# EAGLE schematic perspection-v1 (EAGLE 6.6.0)

## Sheet 1 of 8
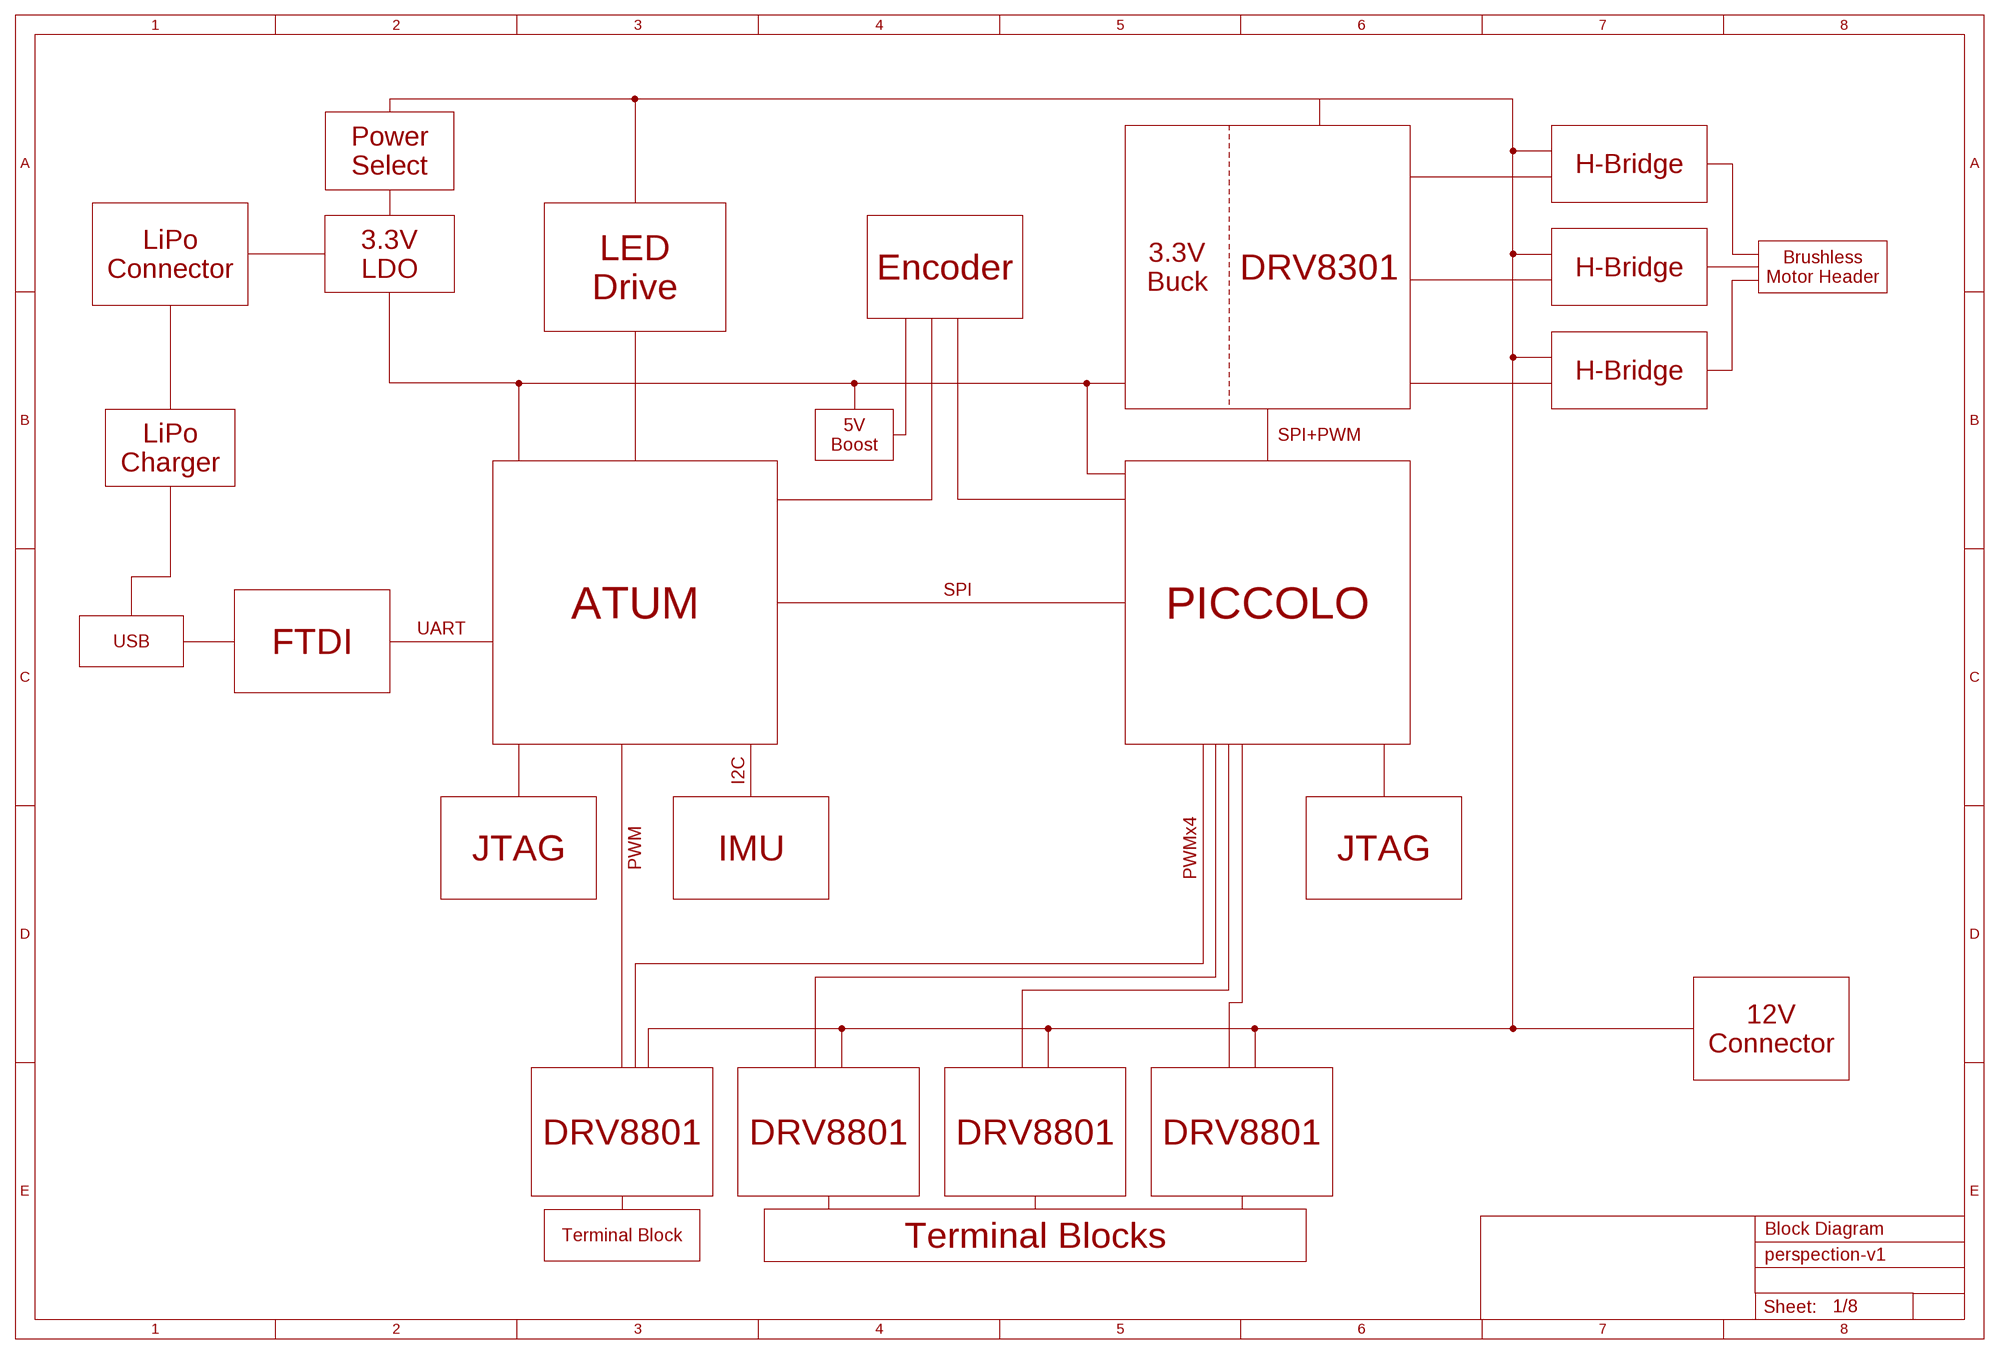
[diagram p0: schematic, sheet 1]

### Notes on the sheet
- Power
  Select
- H-Bridge
- LiPo
  Connector
- 3.3V
  LDO
- LED
  Drive
- Encoder
- 3.3V
  Buck
- DRV8301 | H-Bridge
- Brushless
  Motor Header
- H-Bridge
- 5V
  Boost
- SPI+PWM
- LiPo
  Charger
- SPI
- ATUM | PICCOLO
- UART
- USB | FTDI
- I2C
- JTAG | PWM | IMU | PWMx4 | JTAG
- 12V
  Connector
- DRV8801 | DRV8801 | DRV8801 | DRV8801
- Terminal Block | Terminal Blocks

## Sheet 2 of 8
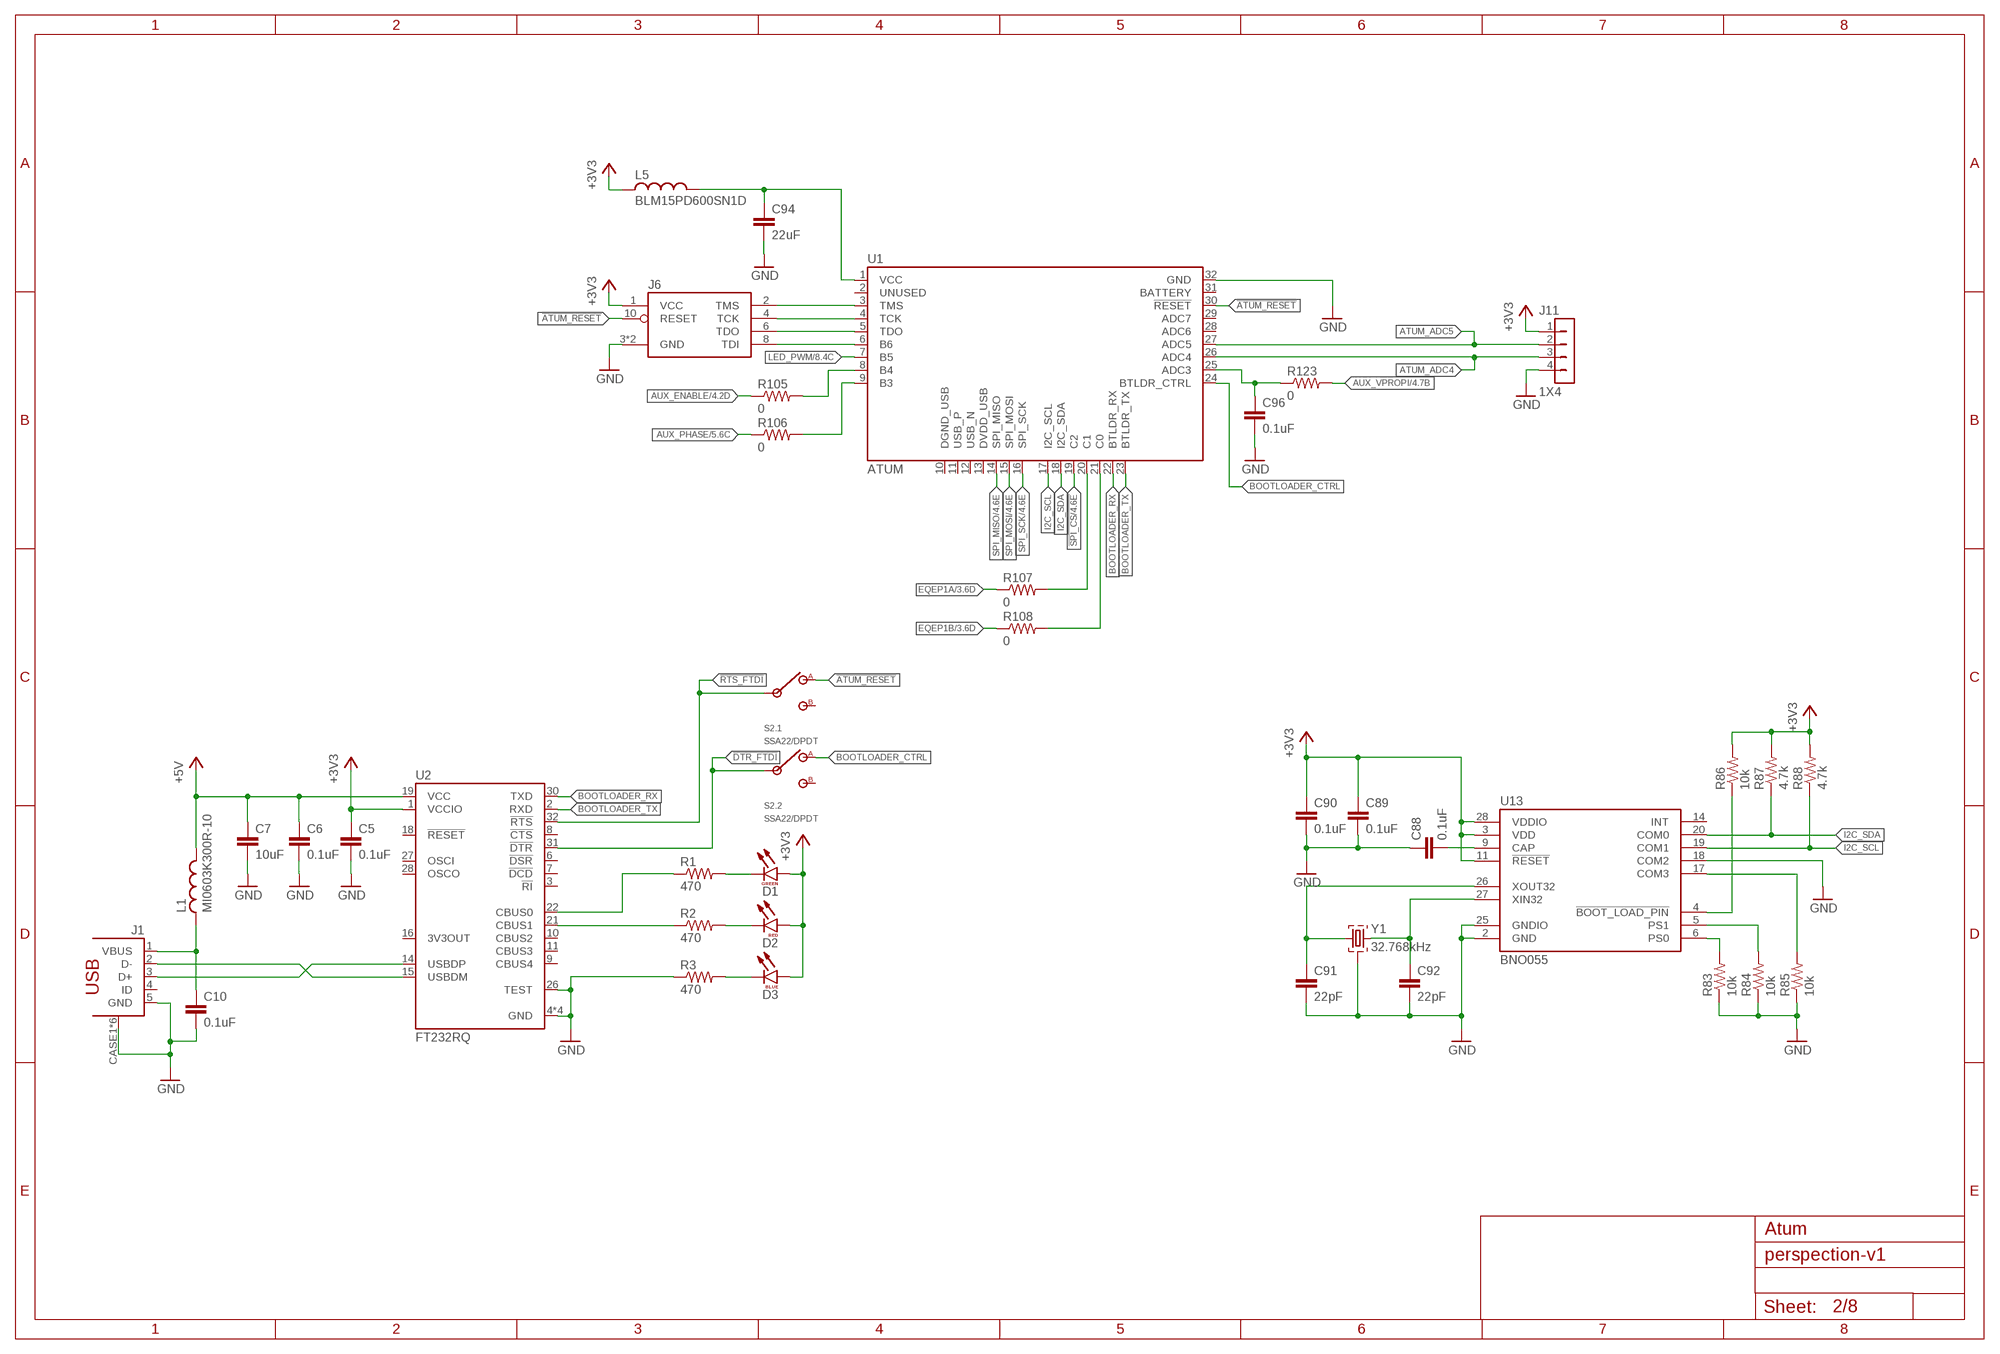
[diagram p1: schematic, sheet 2]

### Parts
C5  0.1uF  C0402  [C0402]
C6  0.1uF  C0402  [C0402]
C7  10uF  C1206  [C1206]
C10  0.1uF  C0402  [C0402]
C88  0.1uF  C0402  [C0402]
C89  0.1uF  C0402  [C0402]
C90  0.1uF  C0402  [C0402]
C91  22pF  C0402  [C0402]
C92  22pF  C0402  [C0402]
C94  22uF  C1206  [C1206]
C96  0.1uF  C0402  [C0402]
D1  LED0603  [LED0603]
D2  LED0603  [LED0603]
D3  LED0603  [LED0603]
J1  MICRO-USB-10118192-0001LF  [MICRO-USB]
J6  JTAG-ARM_TC-10  [TC2050-IDC]
J11  1X4  [1X4_0.1IN_THRUHOLE]
L1  MI0603K300R-10  L0603  [L0603]
L5  BLM15PD600SN1D  L0402  [L0402]
R1  470  R0402  [R0402]
R2  470  R0402  [R0402]
R3  470  R0402  [R0402]
R83  10k  R0402  [R0402]
R84  10k  R0402  [R0402]
R85  10k  R0402  [R0402]
R86  10k  R0402  [R0402]
R87  4.7k  R0402  [R0402]
R88  4.7k  R0402  [R0402]
R105  0  R0402  [R0402]
R106  0  R0402  [R0402]
R107  0  R0402  [R0402]
R108  0  R0402  [R0402]
R123  0  R0402  [R0402]
S2  SSA22/DPDT  [SSA22/DPDT]
U1  ATUM  [ATUM]
U2  FT232RQ  [QFN32]
U13  BNO055  [LGA-28]
Y1  32.768kHz  CM200C32768HZFT  [SOJ-4]

### Nets
!ATUM_RESET: J6.10(RESET) S2.A1 U1.30(!RESET)
!DTR_FTDI: S2.COM2 U2.31(!DTR)
!RTS_FTDI: S2.COM1 U2.32(!RTS)
!SPI_CS: U1.19(C2) ; also sheet 4
+3V3: C5.1 C89.1 C90.1 D1.ANODE D2.ANODE D3.ANODE J6.1(VCC) J11.1 L5.1 R86.2 R87.2 R88.2 U2.1(VCCIO) U13.3(VDD) U13.11(!RESET) U13.28(VDDIO) ; also sheet 3,4,5,6,8
+5V: C6.1 C7.1 L1.2 U2.19(VCC) ; also sheet 3
ATUM_ADC4: J11.3 U1.26(ADC4)
ATUM_ADC5: J11.2 U1.27(ADC5)
ATUM_C0: R108.2 U1.21(C0)
ATUM_C1: R107.2 U1.20(C1)
ATUM_TCK: J6.4(TCK) U1.4(TCK)
ATUM_TDO: J6.6(TDO) U1.5(TDO)
ATUM_TMS: J6.2(TMS) U1.3(TMS)
AUX_ENABLE: R105.1 ; also sheet 4,5
AUX_PHASE: R106.1 ; also sheet 5
AUX_VPROPI: R123.2 ; also sheet 4,5
BOOTLOADER_CTRL: S2.A2 U1.24(BTLDR_CTRL)
BOOTLOADER_RX: U1.22(BTLDR_RX) U2.30(TXD)
BOOTLOADER_TX: U1.23(BTLDR_TX) U2.2(RXD)
D_N: J1.2(D-) U2.15(USBDM)
D_P: J1.3(D+) U2.14(USBDP)
EQEP1A: R107.1 ; also sheet 3,4
EQEP1B: R108.1 ; also sheet 3,4
GND: C5.2 C6.2 C7.2 C10.2 C88.1 C89.2 C90.2 C91.2 C92.2 C94.2 C96.2 J1.5(GND) J1.CASE1(MTN4) J1.CASE2(MTN4) J1.CASE3(MTN4) J1.CASE4(MTN4) J1.CASE5(MTN4) J1.CASE6(MTN4) J6.3(GND) J6.9(GND) J11.4 R3.1 R83.1 R84.1 R85.1 U1.32(GND) U2.4(GND) U2.17(GND) U2.20(GND) U2.24(GND) U2.26(TEST) U13.2(GND) U13.18(COM2) U13.25(GNDIO) Y1.2 Y1.3 ; also sheet 3,4,5,6,7,8
I2C_SCL: R88.1 U1.17(I2C_SCL) U13.19(COM1)
I2C_SDA: R87.1 U1.18(I2C_SDA) U13.20(COM0)
LED_PWM: U1.7(B5) ; also sheet 8
N$1: D2.CATHODE R2.2
N$2: D1.CATHODE R1.2
N$3: R2.1 U2.21(CBUS1)
N$4: R1.1 U2.22(CBUS0)
N$5: D3.CATHODE R3.2
N$7: C96.1 R123.1 U1.25(ADC3)
N$8: C10.1 J1.1(VBUS) L1.1
N$47: R105.2 U1.8(B4)
N$48: R106.2 U1.9(B3)
N$72: R84.2 U13.5(PS1)
N$73: R83.2 U13.6(PS0)
N$74: C92.1 U13.27(XIN32) Y1.4
N$75: C88.2 U13.9(CAP)
N$76: C91.1 U13.26(XOUT32) Y1.1
N$80: R85.2 U13.17(COM3)
N$85: R86.1 U13.4(!BOOT_LOAD_PIN)
N$89: C94.1 L5.2 U1.1(VCC)
N$90: J6.8(TDI) U1.6(B6)
SPI_MISO: U1.14(SPI_MISO) ; also sheet 4
SPI_MOSI: U1.15(SPI_MOSI) ; also sheet 4
SPI_SCK: U1.16(SPI_SCK) ; also sheet 4
Unconnected: J1.4(ID) S2.B1 S2.B2 U1.2(UNUSED) U1.10(DGND_USB) U1.11(USB_P) U1.12(USB_N) U1.13(DVDD_USB) U1.28(ADC6) U1.29(ADC7) U1.31(BATTERY) U2.3(!RI) U2.6(!DSR) U2.7(!DCD) U2.8(!CTS) U2.9(CBUS4) U2.10(CBUS2) U2.11(CBUS3) U2.16(3V3OUT) U2.18(!RESET) U2.27(OSCI) U2.28(OSCO) U13.14(INT)

## Sheet 3 of 8
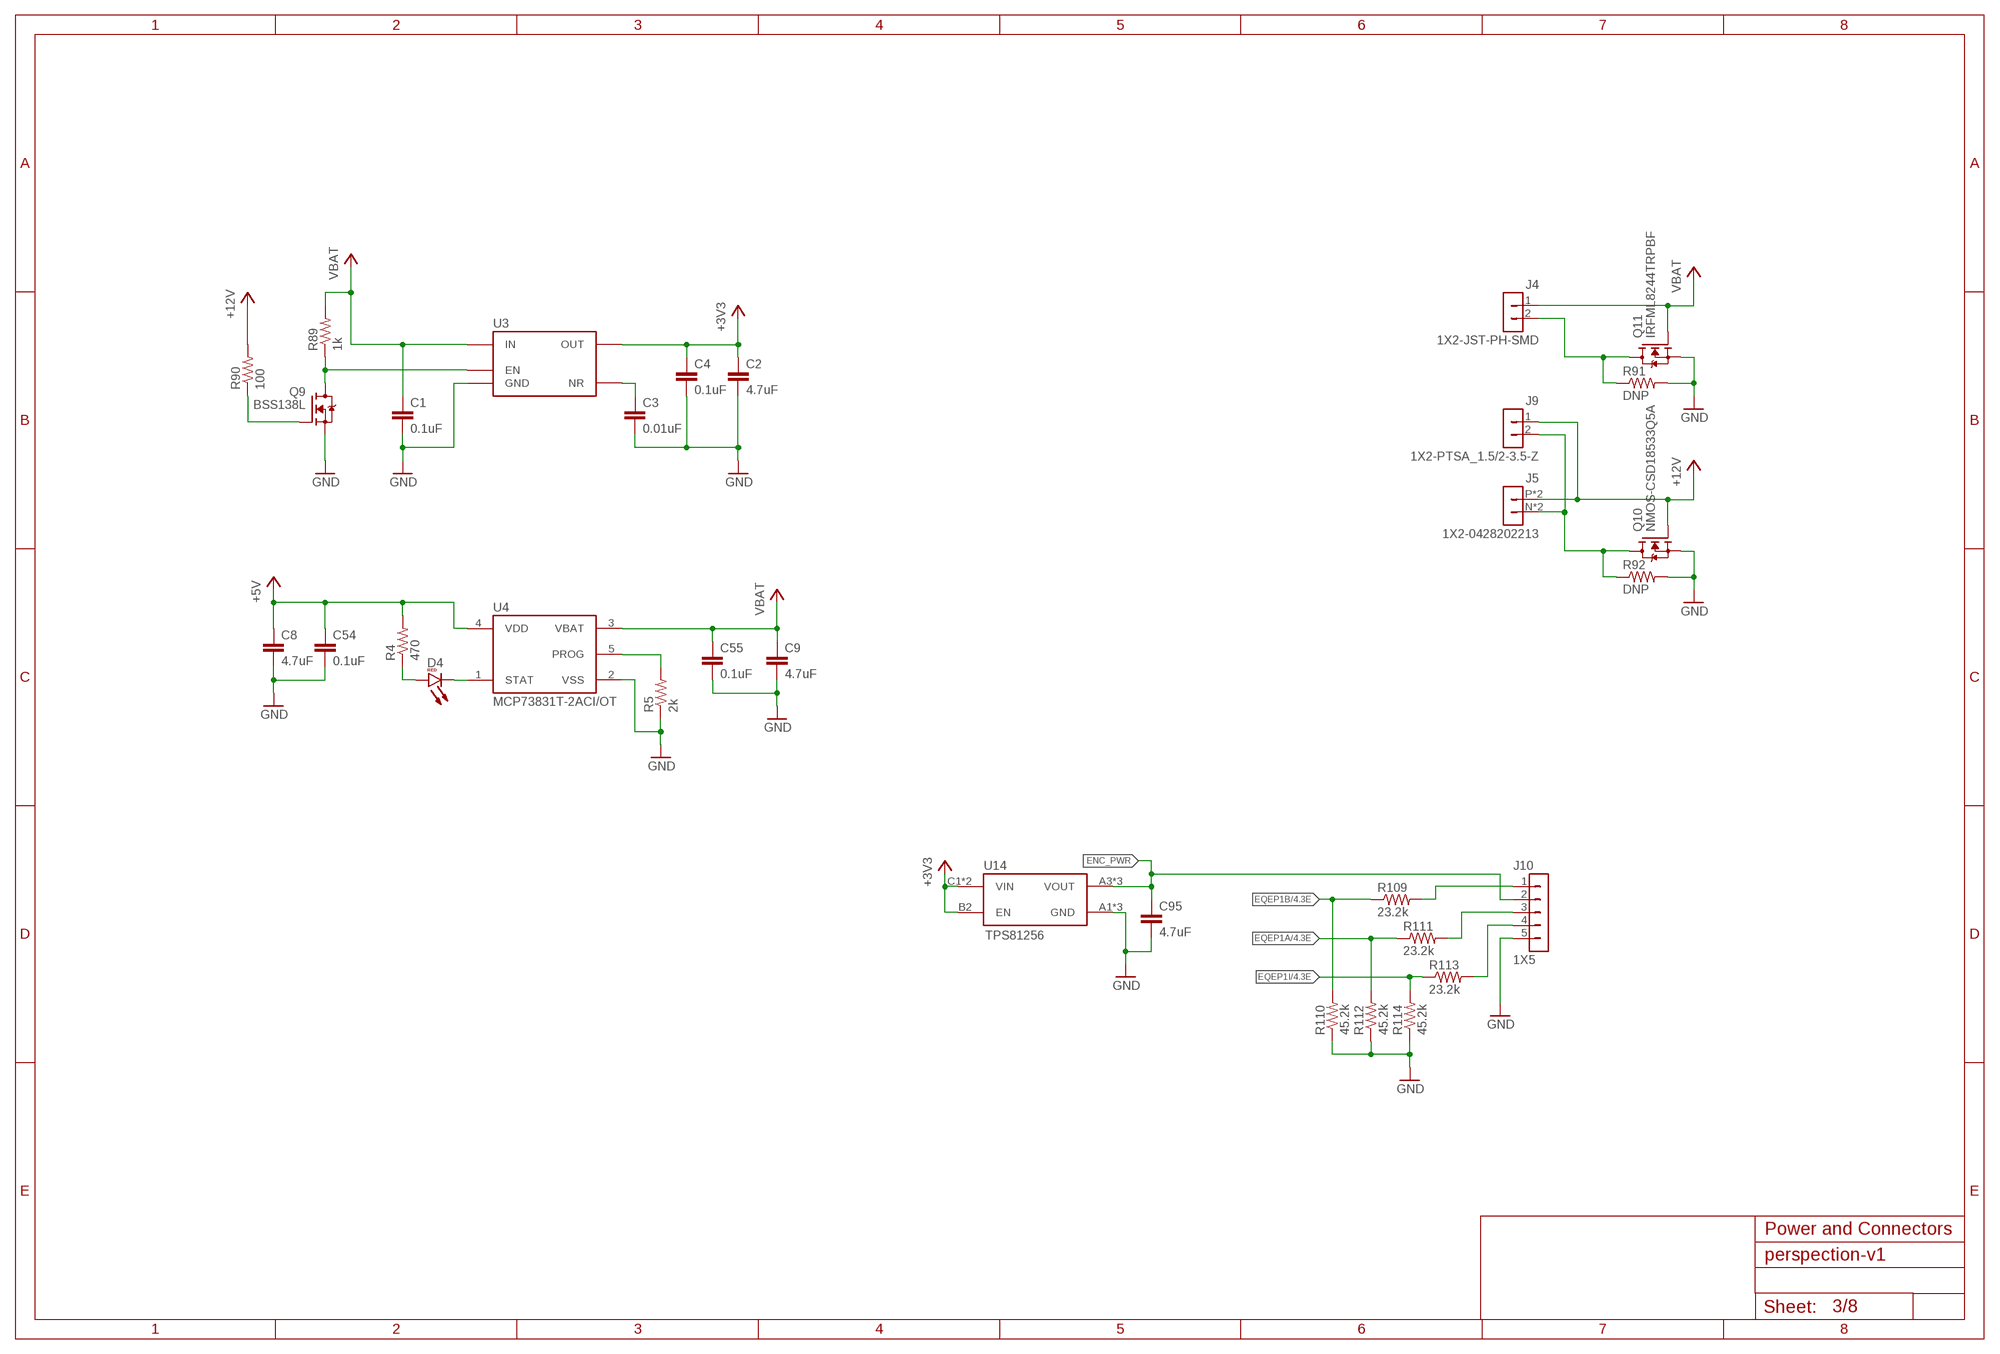
[diagram p2: schematic, sheet 3]

### Parts
C1  0.1uF  C0402  [C0402]
C2  4.7uF  C0805  [C0805]
C3  0.01uF  C0402  [C0402]
C4  0.1uF  C0402  [C0402]
C8  4.7uF  C0805  [C0805]
C9  4.7uF  C0805  [C0805]
C54  0.1uF  C0402  [C0402]
C55  0.1uF  C0402  [C0402]
C95  4.7uF  C0603  [C0603]
D4  LED0603  [LED0603]
J4  1X2-JST-PH-SMD  [JST-PH-2-SMD]
J5  1X2-0428202213  [MOLEX_SABRE_2POS]
J9  1X2-PTSA_1.5/2-3.5-Z  [3.5MM_PTSA_1.5/2-3.5-Z]
J10  1X5  [1X5_0.1IN_THRUHOLE]
Q9  BSS138L  [SOT23]
Q10  NMOS-CSD18533Q5A  [SON-5X6]
Q11  IRFML8244TRPBF  [SOT23]
R4  470  R0402  [R0402]
R5  2k  R0402  [R0402]
R89  1k  R0402  [R0402]
R90  100  R0402  [R0402]
R91  DNP  R0402  [R0402]
R92  DNP  R0805  [R0805]
R109  23.2k  R0402  [R0402]
R110  45.2k  R0402  [R0402]
R111  23.2k  R0402  [R0402]
R112  45.2k  R0402  [R0402]
R113  23.2k  R0402  [R0402]
R114  45.2k  R0402  [R0402]
U3  TPS79933DDCR  [SOT23-5]
U4  MCP73831T-2ACI/OT  [SOT23-5]
U14  TPS81256  [TI-SIP-9]

### Nets
+3V3: C2.1 C4.1 U3.5(OUT) U14.B2(EN) U14.C1(VIN) U14.C2(VIN) ; also sheet 2,4,5,6,8
+5V: C8.1 C54.1 R4.2 U4.4(VDD) ; also sheet 2
+12V: J5.P J5.P2 J9.1 Q10.G R90.2 ; also sheet 5,6,7,8
+12V_GND: J5.N J5.N2 J9.2 Q10.D R92.1
ENC_PWR: C95.1 J10.2 U14.A3(VOUT) U14.B3(VOUT) U14.C3(VOUT)
EQEP1A: R111.1 R112.2 ; also sheet 2,4
EQEP1B: R109.1 R110.2 ; also sheet 2,4
EQEP1I: R113.1 R114.2 ; also sheet 4
GND: C1.2 C2.2 C3.2 C4.2 C8.2 C9.2 C54.2 C55.2 C95.2 J10.5 Q9.2(S) Q10.S1(S) Q10.S2(S) Q10.S3(S) Q11.2(S) R5.1 R91.2 R92.2 R110.1 R112.1 R114.1 U3.2(GND) U4.2(VSS) U14.A1(GND) U14.A2(GND) U14.B1(GND) ; also sheet 2,4,5,6,7,8
N$6: J10.1 R109.2
N$9: D4.CATHODE U4.1(STAT)
N$10: C3.1 U3.4(NR)
N$11: D4.ANODE R4.1
N$12: R5.2 U4.5(PROG)
N$16: J10.3 R111.2
N$17: J10.4 R113.2
N$81: Q9.3(D) R89.1 U3.3(EN)
N$87: Q9.1(G) R90.1
VBAT: C1.1 C9.1 C55.1 J4.1 Q11.1(G) R89.2 U3.1(IN) U4.3(VBAT)
VBAT_GND: J4.2 Q11.3(D) R91.1

## Sheet 4 of 8
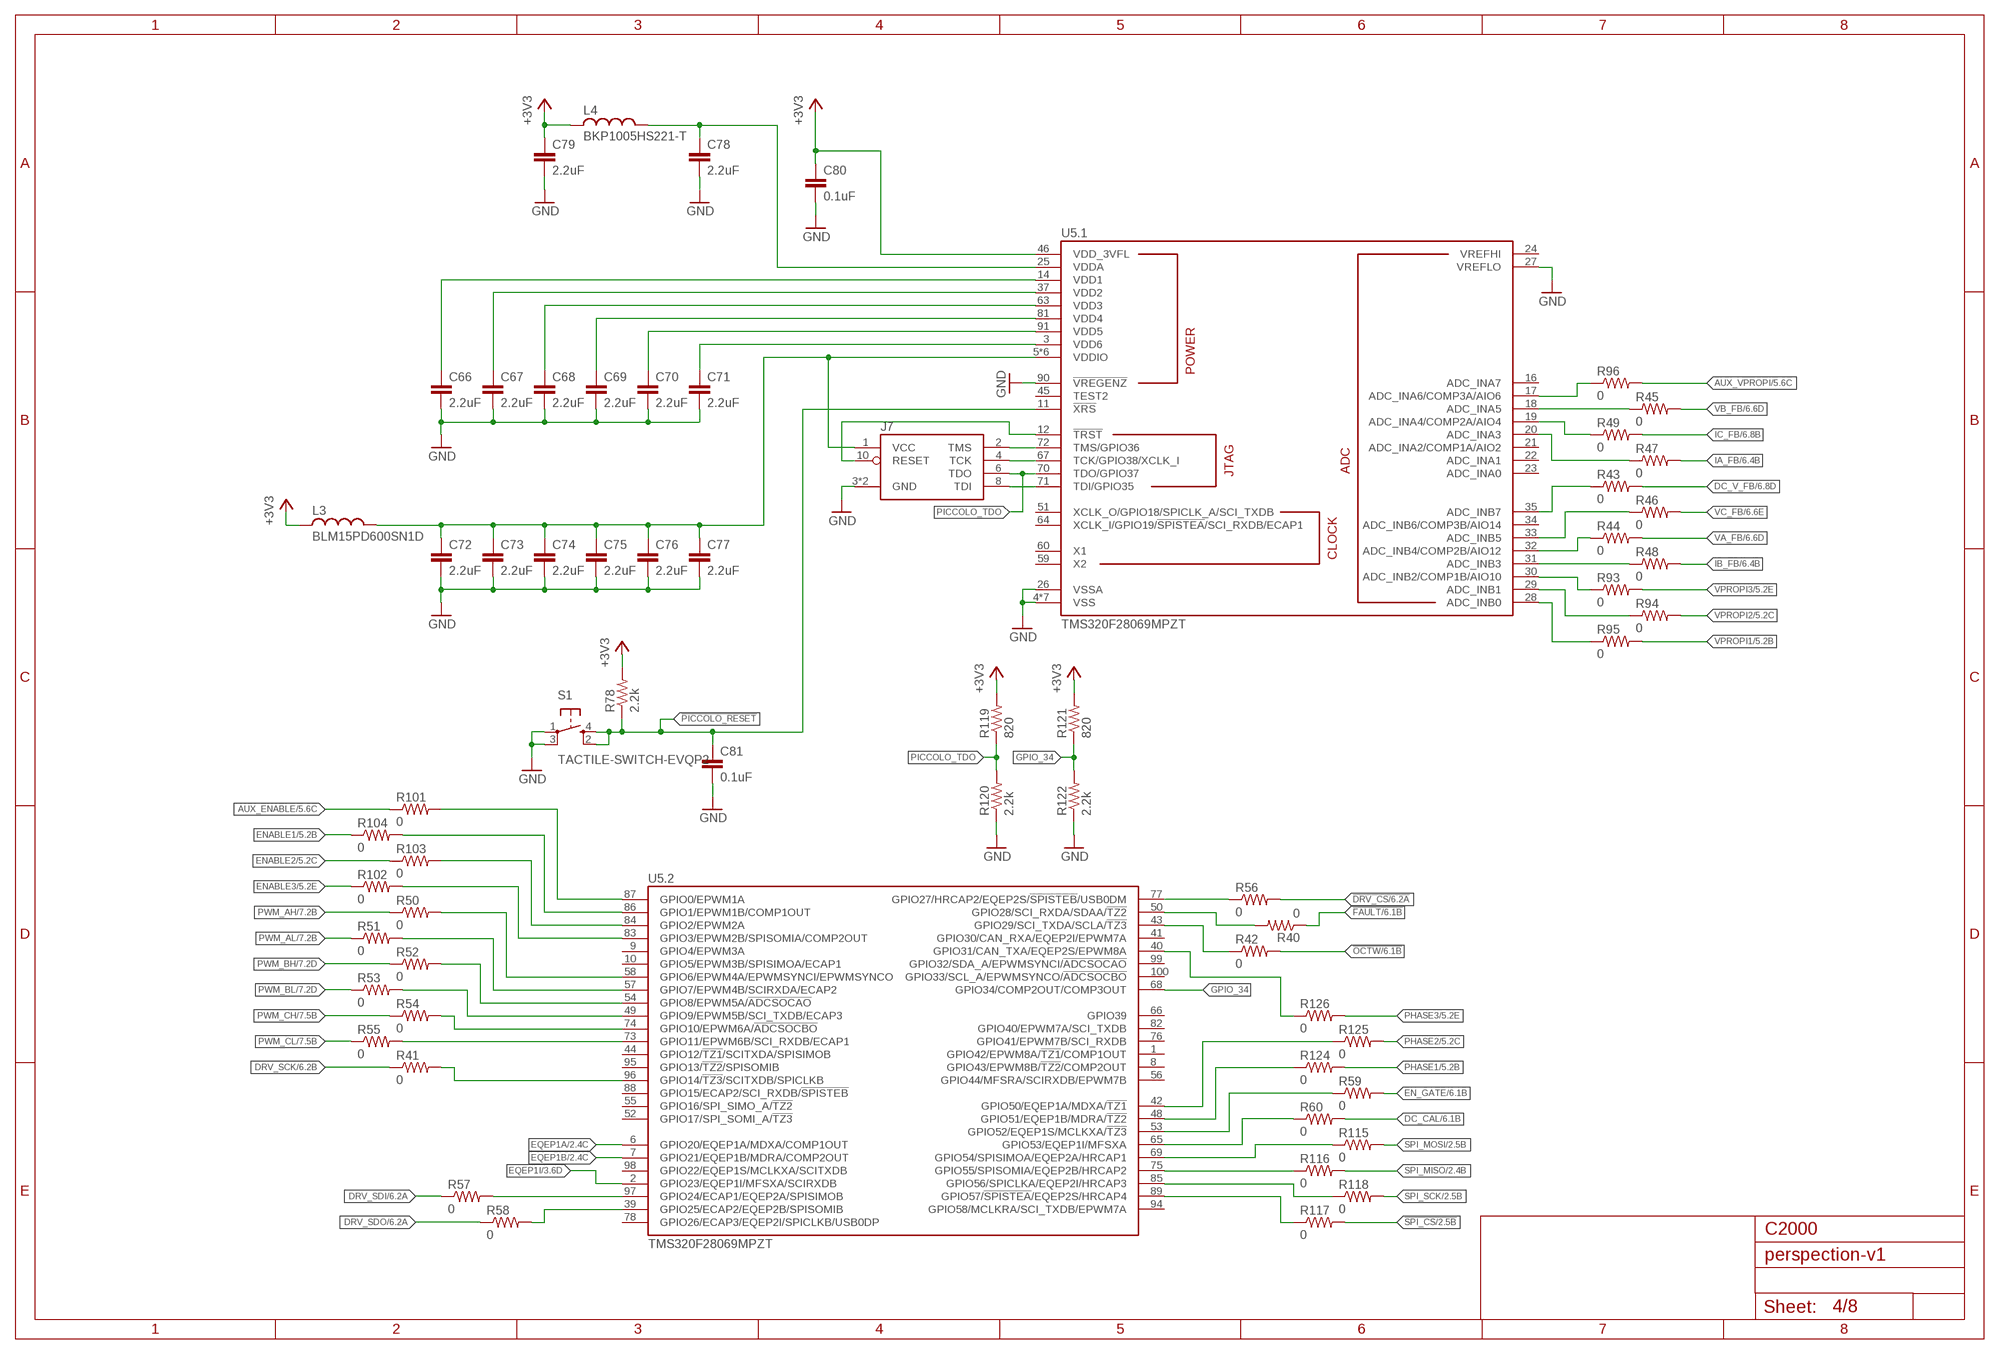
[diagram p3: schematic, sheet 4]

### Parts
C66  2.2uF  C0402  [C0402]
C67  2.2uF  C0402  [C0402]
C68  2.2uF  C0402  [C0402]
C69  2.2uF  C0402  [C0402]
C70  2.2uF  C0402  [C0402]
C71  2.2uF  C0402  [C0402]
C72  2.2uF  C0402  [C0402]
C73  2.2uF  C0402  [C0402]
C74  2.2uF  C0402  [C0402]
C75  2.2uF  C0402  [C0402]
C76  2.2uF  C0402  [C0402]
C77  2.2uF  C0402  [C0402]
C78  2.2uF  C0402  [C0402]
C79  2.2uF  C0402  [C0402]
C80  0.1uF  C0402  [C0402]
C81  0.1uF  C0402  [C0402]
J7  JTAG-ARM_TC-10  [TC2050-IDC]
L3  BLM15PD600SN1D  L0402  [L0402]
L4  BKP1005HS221-T  L0402  [L0402]
R40  0  R0402  [R0402]
R41  0  R0402  [R0402]
R42  0  R0402  [R0402]
R43  0  R0402  [R0402]
R44  0  R0402  [R0402]
R45  0  R0402  [R0402]
R46  0  R0402  [R0402]
R47  0  R0402  [R0402]
R48  0  R0402  [R0402]
R49  0  R0402  [R0402]
R50  0  R0402  [R0402]
R51  0  R0402  [R0402]
R52  0  R0402  [R0402]
R53  0  R0402  [R0402]
R54  0  R0402  [R0402]
R55  0  R0402  [R0402]
R56  0  R0402  [R0402]
R57  0  R0402  [R0402]
R58  0  R0402  [R0402]
R59  0  R0402  [R0402]
R60  0  R0402  [R0402]
R78  2.2k  R0402  [R0402]
R93  0  R0402  [R0402]
R94  0  R0402  [R0402]
R95  0  R0402  [R0402]
R96  0  R0402  [R0402]
R101  0  R0402  [R0402]
R102  0  R0402  [R0402]
R103  0  R0402  [R0402]
R104  0  R0402  [R0402]
R115  0  R0402  [R0402]
R116  0  R0402  [R0402]
R117  0  R0402  [R0402]
R118  0  R0402  [R0402]
R119  820  R0402  [R0402]
R120  2.2k  R0402  [R0402]
R121  820  R0402  [R0402]
R122  2.2k  R0402  [R0402]
R124  0  R0402  [R0402]
R125  0  R0402  [R0402]
R126  0  R0402  [R0402]
S1  TACTILE-SWITCH-EVQP2  [EVQP2]
U5  TMS320F28069MPZT  [TI-LQFP-100]

### Nets
!DRV_CS: R56.2 ; also sheet 6
!FAULT: R40.1 ; also sheet 6
!OCTW: R42.2 ; also sheet 6
!PICCOLO_RESET: C81.1 R78.1 S1.2 S1.4 U5.11(.1:!XRS)
!PICCOLO_TRST: J7.10(RESET) U5.12(.1:!TRST)
!SPI_CS: R117.2 ; also sheet 2
+3V3: C79.1 C80.1 L3.1 L4.1 R78.2 R119.2 R121.2 U5.46(.1:VDD_3VFL) ; also sheet 2,3,5,6,8
_!DRV_CS: R56.1 U5.77(.2:GPIO27/HRCAP2/EQEP2S/!SPISTEB!/USB0DM)
_!SPI_CS: R117.1 U5.89(.2:GPIO57/!SPISTEA!/EQEP2S/HRCAP4)
__IA_FB: R47.1 U5.20(.1:ADC_INA3)
__IB_FB: R48.1 U5.31(.1:ADC_INB3)
__IC_FB: R49.1 U5.19(.1:ADC_INA4/COMP2A/AIO4)
_DC_CAL: R60.1 U5.65(.2:GPIO53/EQEP1I/MFSXA)
_DC_V_FB: R43.1 U5.35(.1:ADC_INB7)
_DRV_SCK: R41.2 U5.96(.2:GPIO14/!TZ3!/SCITXDB/SPICLKB)
_DRV_SDO: R58.2 U5.39(.2:GPIO25/ECAP2/EQEP2B/SPISOMIB)
_EN_GATE: R59.1 U5.53(.2:GPIO52/EQEP1S/MCLKXA/!TZ3)
_PHASE1: R124.1 U5.48(.2:GPIO51/EQEP1B/MDRA/!TZ2)
_PHASE2: R125.1 U5.42(.2:GPIO50/EQEP1A/MDXA/!TZ1)
_PWM_AH: R50.2 U5.58(.2:GPIO6/EPWM4A/EPWMSYNCI/EPWMSYNCO)
_PWM_AL: R51.2 U5.57(.2:GPIO7/EPWM4B/SCIRXDA/ECAP2)
_PWM_BH: R52.2 U5.54(.2:GPIO8/EPWM5A/!ADCSOCAO)
_PWM_BL: R53.2 U5.49(.2:GPIO9/EPWM5B/SCI_TXDB/ECAP3)
_PWM_CH: R54.2 U5.74(.2:GPIO10/EPWM6A/!ADCSOCBO)
_PWM_CL: R55.2 U5.73(.2:GPIO11/EPWM6B/SCI_RXDB/ECAP1)
_SPI_MISO: R116.1 U5.75(.2:GPIO55/SPISOMIA/EQEP2B/HRCAP2)
_SPI_MOSI: R115.1 U5.69(.2:GPIO54/SPISIMOA/EQEP2A/HRCAP1)
_SPI_SCK: R118.1 U5.85(.2:GPIO56/SPICLKA/EQEP2I/HRCAP3)
_VA_FB: R44.1 U5.32(.1:ADC_INB4/COMP2B/AIO12)
_VB_FB: R45.1 U5.18(.1:ADC_INA5)
_VC_FB: R46.1 U5.33(.1:ADC_INB5)
AUX_ENABLE: R101.1 ; also sheet 2,5
AUX_VPROPI: R96.2 ; also sheet 2,5
DC_CAL: R60.2 ; also sheet 6
DC_V_FB: R43.2 ; also sheet 6
DRV_SCK: R41.1 ; also sheet 6
DRV_SDI: R57.1 ; also sheet 6
DRV_SDO: R58.1 ; also sheet 6
EN_GATE: R59.2 ; also sheet 6
ENABLE1: R104.1 ; also sheet 5
ENABLE2: R103.1 ; also sheet 5
ENABLE3: R102.1 ; also sheet 5
EQEP1A: U5.6(.2:GPIO20/EQEP1A/MDXA/COMP1OUT) ; also sheet 2,3
EQEP1B: U5.7(.2:GPIO21/EQEP1B/MDRA/COMP2OUT) ; also sheet 2,3
EQEP1I: U5.2(.2:GPIO23/EQEP1I/MFSXA/SCIRXDB) ; also sheet 3
GND: C66.2 C67.2 C68.2 C69.2 C70.2 C71.2 C72.2 C73.2 C74.2 C75.2 C76.2 C77.2 C78.2 C79.2 C80.2 C81.2 J7.3(GND) J7.9(GND) R120.1 R122.1 S1.1 S1.3 U5.4(.1:VSS) U5.15(.1:VSS) U5.26(.1:VSSA) U5.27(.1:VREFLO) U5.36(.1:VSS) U5.47(.1:VSS) U5.62(.1:VSS) U5.80(.1:VSS) U5.90(.1:!VREGENZ) U5.92(.1:VSS) ; also sheet 2,3,5,6,7,8
GPIO_34: R121.1 R122.2 U5.68(.2:GPIO34/COMP2OUT/COMP3OUT)
IA_FB: R47.2 ; also sheet 6
IB_FB: R48.2 ; also sheet 6
IC_FB: R49.2 ; also sheet 6
N$21: R57.2 U5.97(.2:GPIO24/ECAP1/EQEP2A/SPISIMOB)
N$25: R93.1 U5.30(.1:ADC_INB2/COMP1B/AIO10)
N$26: R94.1 U5.29(.1:ADC_INB1)
N$27: R95.1 U5.28(.1:ADC_INB0)
N$31: R96.1 U5.17(.1:ADC_INA6/COMP3A/AIO6)
N$32: R102.2 U5.83(.2:GPIO3/EPWM2B/SPISOMIA/COMP2OUT)
N$43: R103.2 U5.84(.2:GPIO2/EPWM2A)
N$44: R104.2 U5.86(.2:GPIO1/EPWM1B/COMP1OUT)
N$46: R101.2 U5.87(.2:GPIO0/EPWM1A)
N$49: R42.1 U5.43(.2:GPIO29/SCI_TXDA/SCLA/!TZ3)
N$50: R126.1 U5.40(.2:GPIO31/CAN_TXA/EQEP2S/EPWM8A)
N$51: C72.1 C73.1 C74.1 C75.1 C76.1 C77.1 J7.1(VCC) L3.2 U5.5(.1:VDDIO) U5.13(.1:VDDIO) U5.38(.1:VDDIO) U5.61(.1:VDDIO) U5.79(.1:VDDIO) U5.93(.1:VDDIO)
N$52: R40.2 U5.50(.2:GPIO28/SCI_RXDA/SDAA/!TZ2)
N$56: C78.1 L4.2 U5.25(.1:VDDA)
PHASE1: R124.2 ; also sheet 5
PHASE2: R125.2 ; also sheet 5
PHASE3: R126.2 ; also sheet 5
PICCOLO_TCK: J7.4(TCK) U5.67(.1:TCK/GPIO38/XCLK_I)
PICCOLO_TDI: J7.8(TDI) U5.71(.1:TDI/GPIO35)
PICCOLO_TDO: J7.6(TDO) R119.1 R120.2 U5.70(.1:TDO/GPIO37)
PICCOLO_TMS: J7.2(TMS) U5.72(.1:TMS/GPIO36)
PWM_AH: R50.1 ; also sheet 7
PWM_AL: R51.1 ; also sheet 7
PWM_BH: R52.1 ; also sheet 7
PWM_BL: R53.1 ; also sheet 7
PWM_CH: R54.1 ; also sheet 7
PWM_CL: R55.1 ; also sheet 7
SPI_MISO: R116.2 ; also sheet 2
SPI_MOSI: R115.2 ; also sheet 2
SPI_SCK: R118.2 ; also sheet 2
VA_FB: R44.2 ; also sheet 6
VB_FB: R45.2 ; also sheet 6
VC_FB: R46.2 ; also sheet 6
VDD1: C66.1 U5.14(.1:VDD1)
VDD2: C67.1 U5.37(.1:VDD2)
VDD3: C68.1 U5.63(.1:VDD3)
VDD4: C69.1 U5.81(.1:VDD4)
VDD5: C70.1 U5.91(.1:VDD5)
VDD6: C71.1 U5.3(.1:VDD6)
VPROPI1: R95.2 ; also sheet 5
VPROPI2: R94.2 ; also sheet 5
VPROPI3: R93.2 ; also sheet 5
Unconnected: U5.1(.2:GPIO42/EPWM8A/!TZ1!/COMP1OUT) U5.8(.2:GPIO43/EPWM8B/!TZ2!/COMP2OUT) U5.9(.2:GPIO4/EPWM3A) U5.10(.2:GPIO5/EPWM3B/SPISIMOA/ECAP1) U5.16(.1:ADC_INA7) U5.21(.1:ADC_INA2/COMP1A/AIO2) U5.22(.1:ADC_INA1) U5.23(.1:ADC_INA0) U5.24(.1:VREFHI) U5.34(.1:ADC_INB6/COMP3B/AIO14) U5.41(.2:GPIO30/CAN_RXA/EQEP2I/EPWM7A) U5.44(.2:GPIO12/!TZ1!/SCITXDA/SPISIMOB) U5.45(.1:TEST2) U5.51(.1:XCLK_O/GPIO18/SPICLK_A/SCI_TXDB) U5.52(.2:GPIO17/SPI_SOMI_A/!TZ3) U5.55(.2:GPIO16/SPI_SIMO_A/!TZ2) U5.56(.2:GPIO44/MFSRA/SCIRXDB/EPWM7B) U5.59(.1:X2) U5.60(.1:X1) U5.64(.1:XCLK_I/GPIO19/!SPISTEA!/SCI_RXDB/ECAP1) U5.66(.2:GPIO39) U5.76(.2:GPIO41/EPWM7B/SCI_RXDB) U5.78(.2:GPIO26/ECAP3/EQEP2I/SPICLKB/USB0DP) U5.82(.2:GPIO40/EPWM7A/SCI_TXDB) U5.88(.2:GPIO15/ECAP2/SCI_RXDB/!SPISTEB) U5.94(.2:GPIO58/MCLKRA/SCI_TXDB/EPWM7A) U5.95(.2:GPIO13/!TZ2!/SPISOMIB) U5.98(.2:GPIO22/EQEP1S/MCLKXA/SCITXDB) U5.99(.2:GPIO32/SDA_A/EPWMSYNCI/!ADCSOCAO) U5.100(.2:GPIO33/SCL_A/EPWMSYNCO/!ADCSOCBO)

## Sheet 5 of 8
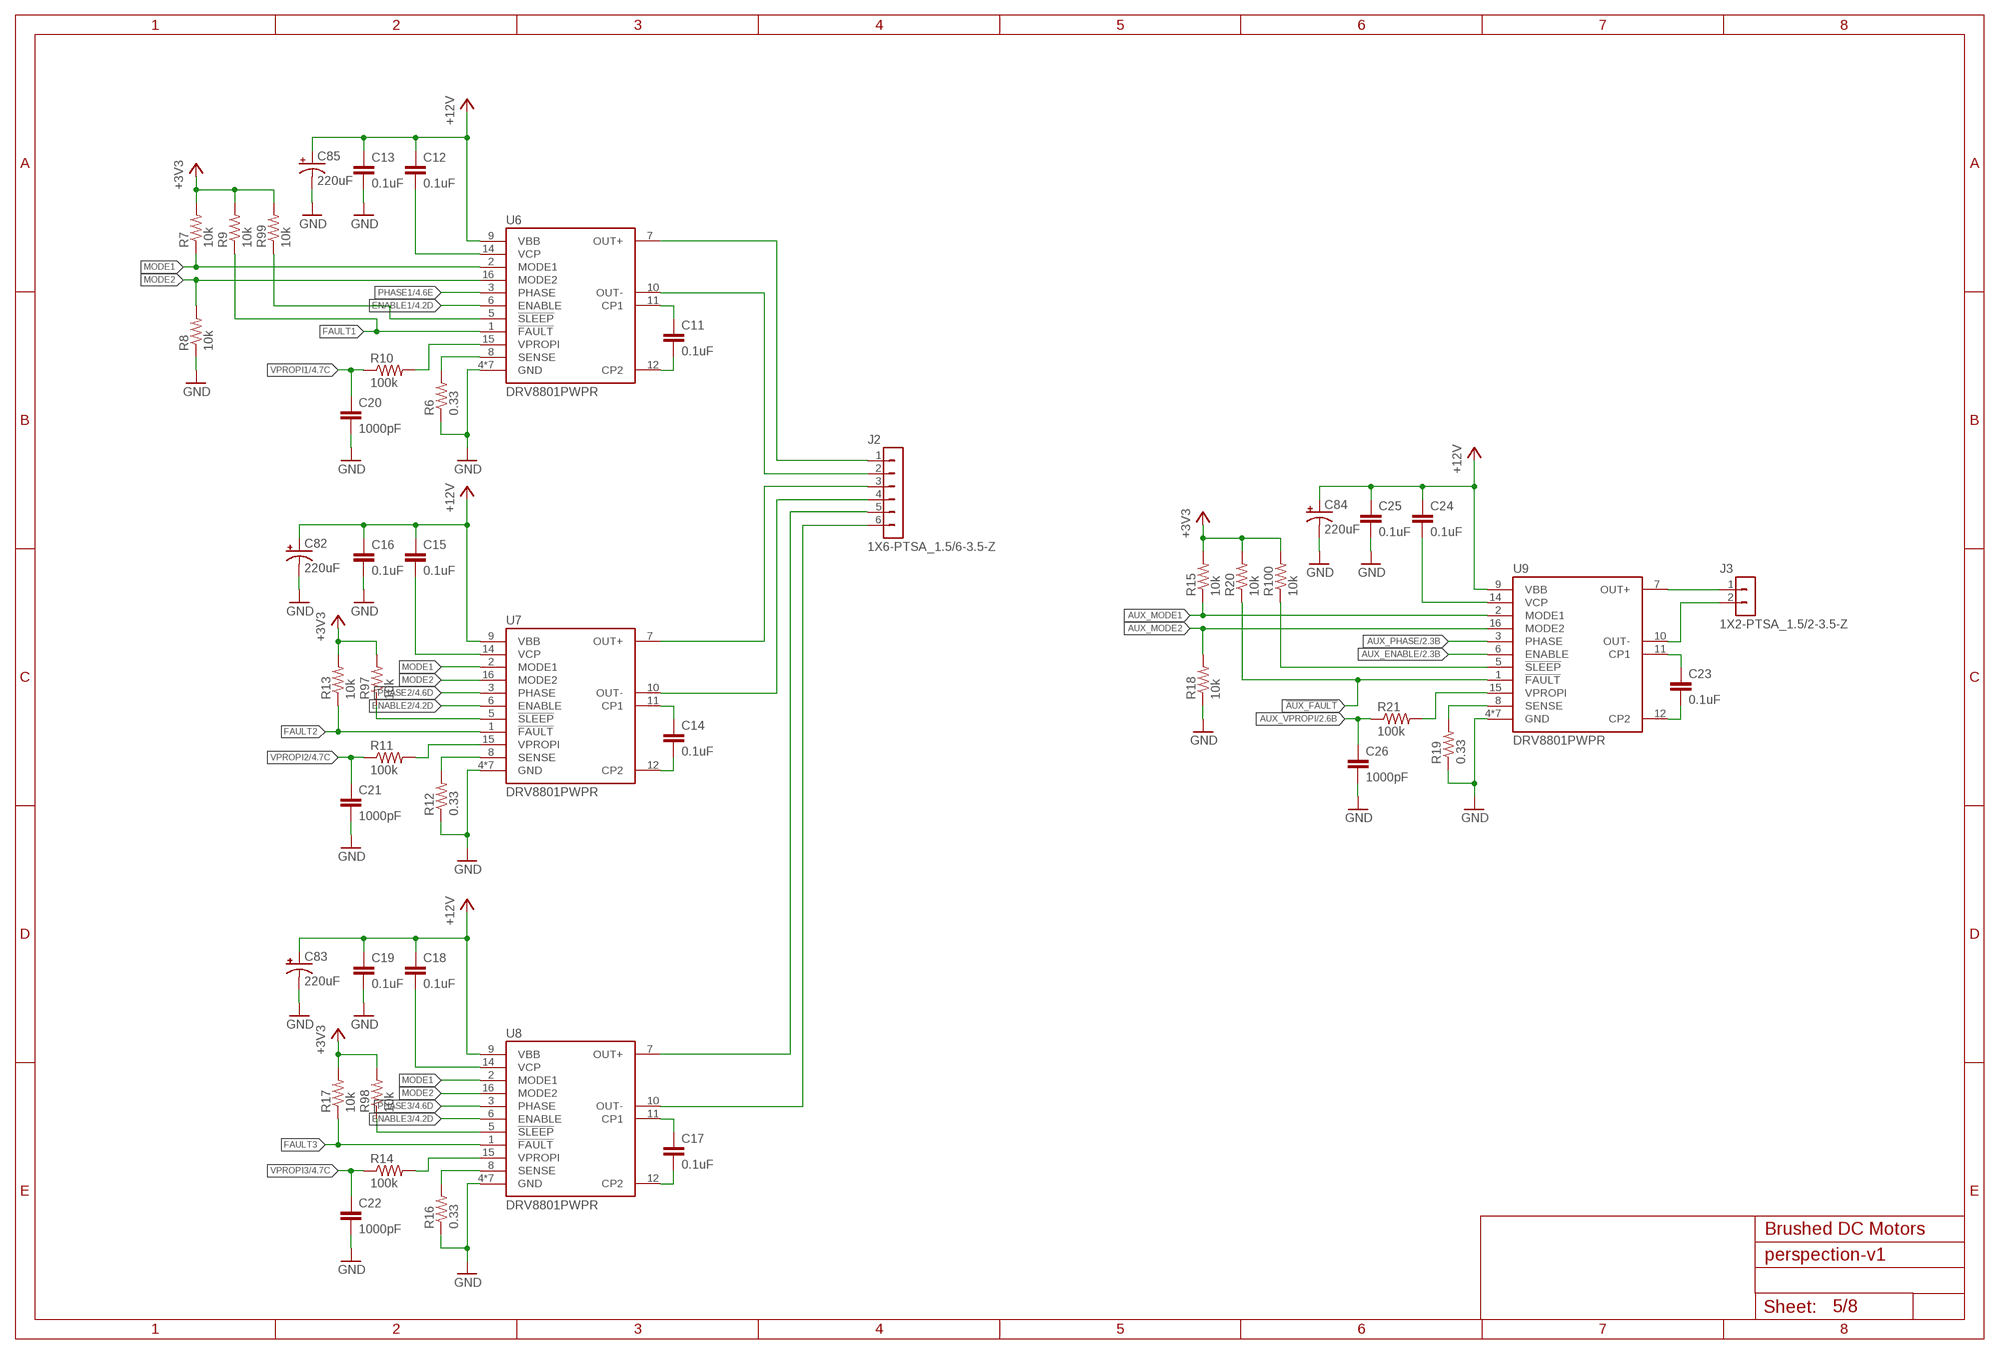
[diagram p4: schematic, sheet 5]

### Parts
C11  0.1uF  C0402  [C0402]
C12  0.1uF  C0402  [C0402]
C13  0.1uF  C0402  [C0402]
C14  0.1uF  C0402  [C0402]
C15  0.1uF  C0402  [C0402]
C16  0.1uF  C0402  [C0402]
C17  0.1uF  C0402  [C0402]
C18  0.1uF  C0402  [C0402]
C19  0.1uF  C0402  [C0402]
C20  1000pF  C0402  [C0402]
C21  1000pF  C0402  [C0402]
C22  1000pF  C0402  [C0402]
C23  0.1uF  C0402  [C0402]
C24  0.1uF  C0402  [C0402]
C25  0.1uF  C0402  [C0402]
C26  1000pF  C0402  [C0402]
C82  220uF  CPOL-PANASONIC-6.3MM-SMD-220UF-25V  [PANASONIC-6.3MM-SMD]
C83  220uF  CPOL-PANASONIC-6.3MM-SMD-220UF-25V  [PANASONIC-6.3MM-SMD]
C84  220uF  CPOL-PANASONIC-6.3MM-SMD-220UF-25V  [PANASONIC-6.3MM-SMD]
C85  220uF  CPOL-PANASONIC-6.3MM-SMD-220UF-25V  [PANASONIC-6.3MM-SMD]
J2  1X6-PTSA_1.5/6-3.5-Z  [3.5MM_PTSA_1.5/6-3.5-Z]
J3  1X2-PTSA_1.5/2-3.5-Z  [3.5MM_PTSA_1.5/2-3.5-Z]
R6  0.33  R1206  [R1206]
R7  10k  R0402  [R0402]
R8  10k  R0402  [R0402]
R9  10k  R0402  [R0402]
R10  100k  R0402  [R0402]
R11  100k  R0402  [R0402]
R12  0.33  R1206  [R1206]
R13  10k  R0402  [R0402]
R14  100k  R0402  [R0402]
R15  10k  R0402  [R0402]
R16  0.33  R1206  [R1206]
R17  10k  R0402  [R0402]
R18  10k  R0402  [R0402]
R19  0.33  R1206  [R1206]
R20  10k  R0402  [R0402]
R21  100k  R0402  [R0402]
R97  10k  R0402  [R0402]
R98  10k  R0402  [R0402]
R99  10k  R0402  [R0402]
R100  10k  R0402  [R0402]
U6  DRV8801PWPR  [TI-HTSSOP-16]
U7  DRV8801PWPR  [TI-HTSSOP-16]
U8  DRV8801PWPR  [TI-HTSSOP-16]
U9  DRV8801PWPR  [TI-HTSSOP-16]

### Nets
!AUX_FAULT: R20.1 U9.1(!FAULT)
!AUX_SLEEP: R100.1 U9.5(!SLEEP)
!SLEEP1: R99.1 U6.5(!SLEEP)
!SLEEP2: R97.1 U7.5(!SLEEP)
!SLEEP3: R98.1 U8.5(!SLEEP)
+3V3: R7.2 R9.2 R13.2 R15.2 R17.2 R20.2 R97.2 R98.2 R99.2 R100.2 ; also sheet 2,3,4,6,8
+12V: C12.1 C13.1 C15.1 C16.1 C18.1 C19.1 C24.1 C25.1 C82.POS(+) C83.POS(+) C84.POS(+) C85.POS(+) U6.9(VBB) U7.9(VBB) U8.9(VBB) U9.9(VBB) ; also sheet 3,6,7,8
_AUX_VPROPI: R21.2 U9.15(VPROPI)
_VPROPI1: R10.2 U6.15(VPROPI)
_VPROPI2: R11.2 U7.15(VPROPI)
_VPROPI3: R14.2 U8.15(VPROPI)
AUX_ENABLE: U9.6(ENABLE) ; also sheet 2,4
AUX_MODE1: R15.1 U9.2(MODE1)
AUX_MODE2: R18.2 U9.16(MODE2)
AUX_PHASE: U9.3(PHASE) ; also sheet 2
AUX_SENSE: R19.2 U9.8(SENSE)
AUX_VPROPI: C26.1 R21.1 ; also sheet 2,4
ENABLE1: U6.6(ENABLE) ; also sheet 4
ENABLE2: U7.6(ENABLE) ; also sheet 4
ENABLE3: U8.6(ENABLE) ; also sheet 4
FAULT1: R9.1 U6.1(!FAULT)
FAULT2: R13.1 U7.1(!FAULT)
FAULT3: R17.1 U8.1(!FAULT)
GND: C13.2 C16.2 C19.2 C20.2 C21.2 C22.2 C25.2 C26.2 C82.NEG(-) C83.NEG(-) C84.NEG(-) C85.NEG(-) R6.1 R8.1 R12.1 R16.1 R18.1 R19.1 U6.4(GND) U6.13(GND) U6.PAD(GND) U6.THERM1(GND) U6.THERM2(GND) U6.THERM3(GND) U6.THERM4(GND) U7.4(GND) U7.13(GND) U7.PAD(GND) U7.THERM1(GND) U7.THERM2(GND) U7.THERM3(GND) U7.THERM4(GND) U8.4(GND) U8.13(GND) U8.PAD(GND) U8.THERM1(GND) U8.THERM2(GND) U8.THERM3(GND) U8.THERM4(GND) U9.4(GND) U9.13(GND) U9.PAD(GND) U9.THERM1(GND) U9.THERM2(GND) U9.THERM3(GND) U9.THERM4(GND) ; also sheet 2,3,4,6,7,8
M1+: J2.1 U6.7(OUT+)
M1-: J2.2 U6.10(OUT-)
M2+: J2.3 U7.7(OUT+)
M2-: J2.4 U7.10(OUT-)
M3+: J2.5 U8.7(OUT+)
M3-: J2.6 U8.10(OUT-)
M_AUX+: J3.1 U9.7(OUT+)
M_AUX-: J3.2 U9.10(OUT-)
MODE1: R7.1 U6.2(MODE1) U7.2(MODE1) U8.2(MODE1)
MODE2: R8.2 U6.16(MODE2) U7.16(MODE2) U8.16(MODE2)
N$13: C11.2 U6.12(CP2)
N$14: C11.1 U6.11(CP1)
N$15: C12.2 U6.14(VCP)
N$18: C14.2 U7.12(CP2)
N$19: C14.1 U7.11(CP1)
N$20: C15.2 U7.14(VCP)
N$22: C17.2 U8.12(CP2)
N$23: C17.1 U8.11(CP1)
N$24: C18.2 U8.14(VCP)
N$28: C23.2 U9.12(CP2)
N$29: C23.1 U9.11(CP1)
N$30: C24.2 U9.14(VCP)
PHASE1: U6.3(PHASE) ; also sheet 4
PHASE2: U7.3(PHASE) ; also sheet 4
PHASE3: U8.3(PHASE) ; also sheet 4
SENSE1: R6.2 U6.8(SENSE)
SENSE2: R12.2 U7.8(SENSE)
SENSE3: R16.2 U8.8(SENSE)
VPROPI1: C20.1 R10.1 ; also sheet 4
VPROPI2: C21.1 R11.1 ; also sheet 4
VPROPI3: C22.1 R14.1 ; also sheet 4

## Sheet 6 of 8
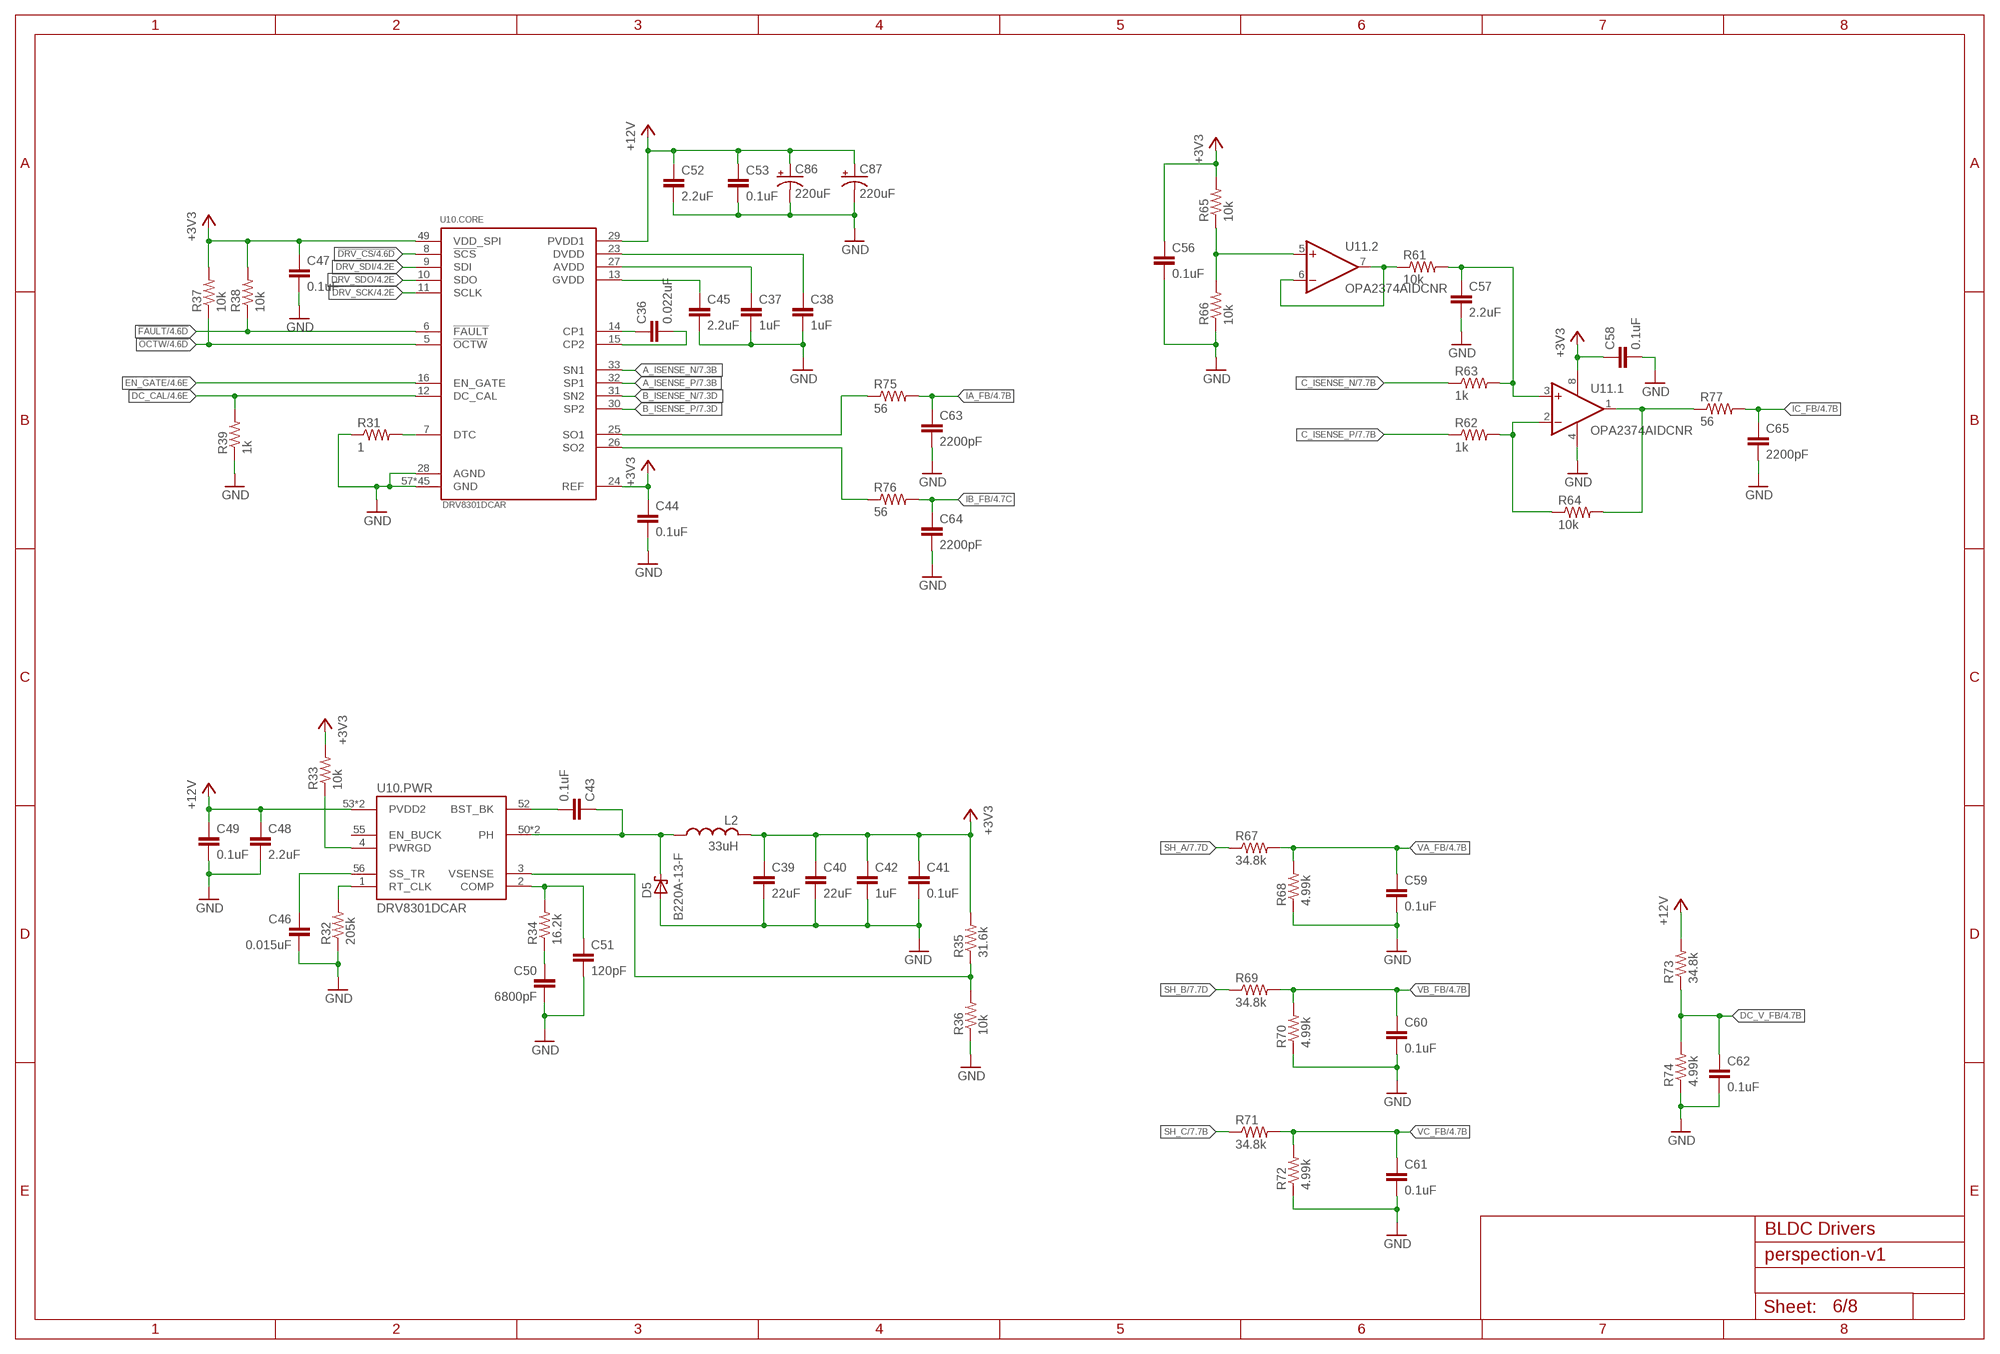
[diagram p5: schematic, sheet 6]

### Parts
C36  0.022uF  C0402  [C0402]
C37  1uF  C0402  [C0402]
C38  1uF  C0402  [C0402]
C39  22uF  C1210  [C1210]
C40  22uF  C1210  [C1210]
C41  0.1uF  C0402  [C0402]
C42  1uF  C0805  [C0805]
C43  0.1uF  C0402  [C0402]
C44  0.1uF  C0402  [C0402]
C45  2.2uF  C0603  [C0603]
C46  0.015uF  C0402  [C0402]
C47  0.1uF  C0402  [C0402]
C48  2.2uF  C0805  [C0805]
C49  0.1uF  C0402  [C0402]
C50  6800pF  C0402  [C0402]
C51  120pF  C0402  [C0402]
C52  2.2uF  C0805  [C0805]
C53  0.1uF  C0402  [C0402]
C56  0.1uF  C0402  [C0402]
C57  2.2uF  C0402  [C0402]
C58  0.1uF  C0402  [C0402]
C59  0.1uF  C0402  [C0402]
C60  0.1uF  C0402  [C0402]
C61  0.1uF  C0402  [C0402]
C62  0.1uF  C0402  [C0402]
C63  2200pF  C0402  [C0402]
C64  2200pF  C0402  [C0402]
C65  2200pF  C0402  [C0402]
C86  220uF  CPOL-PANASONIC-6.3MM-SMD-220UF-25V  [PANASONIC-6.3MM-SMD]
C87  220uF  CPOL-PANASONIC-6.3MM-SMD-220UF-25V  [PANASONIC-6.3MM-SMD]
D5  B220A-13-F  [SMB]
L2  33uH  DR74  [DR74]
R31  1  R0402  [R0402]
R32  205k  R0402  [R0402]
R33  10k  R0402  [R0402]
R34  16.2k  R0402  [R0402]
R35  31.6k  R0402  [R0402]
R36  10k  R0402  [R0402]
R37  10k  R0402  [R0402]
R38  10k  R0402  [R0402]
R39  1k  R0402  [R0402]
R61  10k  R0402  [R0402]
R62  1k  R0402  [R0402]
R63  1k  R0402  [R0402]
R64  10k  R0402  [R0402]
R65  10k  R0402  [R0402]
R66  10k  R0402  [R0402]
R67  34.8k  R0402  [R0402]
R68  4.99k  R0402  [R0402]
R69  34.8k  R0402  [R0402]
R70  4.99k  R0402  [R0402]
R71  34.8k  R0402  [R0402]
R72  4.99k  R0402  [R0402]
R73  34.8k  R0402  [R0402]
R74  4.99k  R0402  [R0402]
R75  56  R0402  [R0402]
R76  56  R0402  [R0402]
R77  56  R0402  [R0402]
U10  DRV8301DCAR  [TI-HTSSOP-56]
U11  OPA2374AIDCNR  [TI-SOT23-8]

### Nets
!DRV_CS: U10.8(.CORE:!SCS) ; also sheet 4
!FAULT: R38.1 U10.6(.CORE:!FAULT) ; also sheet 4
!OCTW: R37.1 U10.5(.CORE:!OCTW) ; also sheet 4
+3V3: C39.1 C40.1 C41.1 C42.1 C44.1 C47.1 C56.1 C58.1 L2.1 R33.2 R35.2 R37.2 R38.2 R65.2 U10.24(.CORE:REF) U10.49(.CORE:VDD_SPI) U11.8(.1:V+) ; also sheet 2,3,4,5,8
+12V: C48.1 C49.1 C52.1 C53.1 C86.POS(+) C87.POS(+) R73.2 U10.29(.CORE:PVDD1) U10.53(.PWR:PVDD2) U10.54(.PWR:PVDD2) ; also sheet 3,5,7,8
_COMP: C50.1 R34.1
_IA_FB: R75.1 U10.25(.CORE:SO1)
_IB_FB: R76.1 U10.26(.CORE:SO2)
_IC_FB: R64.2 R77.1 U11.1(.1:OUT)
A_ISENSE_N: U10.33(.CORE:SN1) ; also sheet 7
A_ISENSE_P: U10.32(.CORE:SP1) ; also sheet 7
AVDD: C37.1 U10.27(.CORE:AVDD)
B_ISENSE_N: U10.31(.CORE:SN2) ; also sheet 7
B_ISENSE_P: U10.30(.CORE:SP2) ; also sheet 7
BST_BK: C43.2 U10.52(.PWR:BST_BK)
C_ISENSE_N: R63.1 ; also sheet 7
C_ISENSE_P: R62.1 ; also sheet 7
COMP: C51.1 R34.2 U10.2(.PWR:COMP)
DC_CAL: R39.2 U10.12(.CORE:DC_CAL) ; also sheet 4
DC_V_FB: C62.1 R73.1 R74.2 ; also sheet 4
DRV_SCK: U10.11(.CORE:SCLK) ; also sheet 4
DRV_SDI: U10.9(.CORE:SDI) ; also sheet 4
DRV_SDO: U10.10(.CORE:SDO) ; also sheet 4
DTC: R31.2 U10.7(.CORE:DTC)
DVDD: C38.1 U10.23(.CORE:DVDD)
EN_GATE: U10.16(.CORE:EN_GATE) ; also sheet 4
GND: C37.2 C38.2 C39.2 C40.2 C41.2 C42.2 C44.2 C45.2 C46.2 C47.2 C48.2 C49.2 C50.2 C51.2 C52.2 C53.2 C56.2 C57.2 C58.2 C59.2 C60.2 C61.2 C62.2 C63.2 C64.2 C65.2 C86.NEG(-) C87.NEG(-) D5.A R31.1 R32.1 R36.1 R39.1 R66.1 R68.1 R70.1 R72.1 R74.1 U10.28(.CORE:AGND) U10.57(.CORE:GND) U10.P$58(.CORE:GND) U10.P$59(.CORE:GND) U10.P$60(.CORE:GND) U10.P$61(.CORE:GND) U10.P$62(.CORE:GND) U10.P$63(.CORE:GND) U10.P$64(.CORE:GND) U10.P$65(.CORE:GND) U10.P$66(.CORE:GND) U10.P$67(.CORE:GND) U10.P$68(.CORE:GND) U10.P$69(.CORE:GND) U10.P$70(.CORE:GND) U10.P$71(.CORE:GND) U10.P$72(.CORE:GND) U10.P$73(.CORE:GND) U10.P$74(.CORE:GND) U10.P$75(.CORE:GND) U10.P$76(.CORE:GND) U10.P$77(.CORE:GND) U10.P$78(.CORE:GND) U10.P$79(.CORE:GND) U10.P$80(.CORE:GND) U10.P$81(.CORE:GND) U10.P$82(.CORE:GND) U10.P$83(.CORE:GND) U10.P$84(.CORE:GND) U10.P$85(.CORE:GND) U10.P$86(.CORE:GND) U10.P$87(.CORE:GND) U10.P$88(.CORE:GND) U10.P$89(.CORE:GND) U10.P$90(.CORE:GND) U10.P$91(.CORE:GND) U10.P$92(.CORE:GND) U10.P$93(.CORE:GND) U10.P$94(.CORE:GND) U10.P$95(.CORE:GND) U10.P$96(.CORE:GND) U10.P$97(.CORE:GND) U10.P$98(.CORE:GND) U10.P$99(.CORE:GND) U10.P$100(.CORE:GND) U10.P$101(.CORE:GND) U11.4(.1:V-) ; also sheet 2,3,4,5,7,8
GVDD: C45.1 U10.13(.CORE:GVDD)
IA_FB: C63.1 R75.2 ; also sheet 4
IB_FB: C64.1 R76.2 ; also sheet 4
IC_FB: C65.1 R77.2 ; also sheet 4
N$41: C36.1 U10.14(.CORE:CP1)
N$42: C36.2 U10.15(.CORE:CP2)
N$77: R61.1 U11.6(.2:-IN) U11.7(.2:OUT)
N$78: C57.1 R61.2 R63.2 U11.3(.1:+IN)
N$79: R62.2 R64.1 U11.2(.1:-IN)
N$82: R65.1 R66.2 U11.5(.2:+IN)
PH: C43.1 D5.C L2.2 U10.50(.PWR:PH) U10.51(.PWR:PH)
PWRGD: R33.1 U10.4(.PWR:PWRGD)
RT_CLK: R32.2 U10.1(.PWR:RT_CLK)
SH_A: R67.1 ; also sheet 7
SH_B: R69.1 ; also sheet 7
SH_C: R71.1 ; also sheet 7
SS_TR: C46.1 U10.56(.PWR:SS_TR)
VA_FB: C59.1 R67.2 R68.2 ; also sheet 4
VB_FB: C60.1 R69.2 R70.2 ; also sheet 4
VC_FB: C61.1 R71.2 R72.2 ; also sheet 4
VFB: R35.1 R36.2 U10.3(.PWR:VSENSE)
Unconnected: U10.55(.PWR:EN_BUCK)

## Sheet 7 of 8
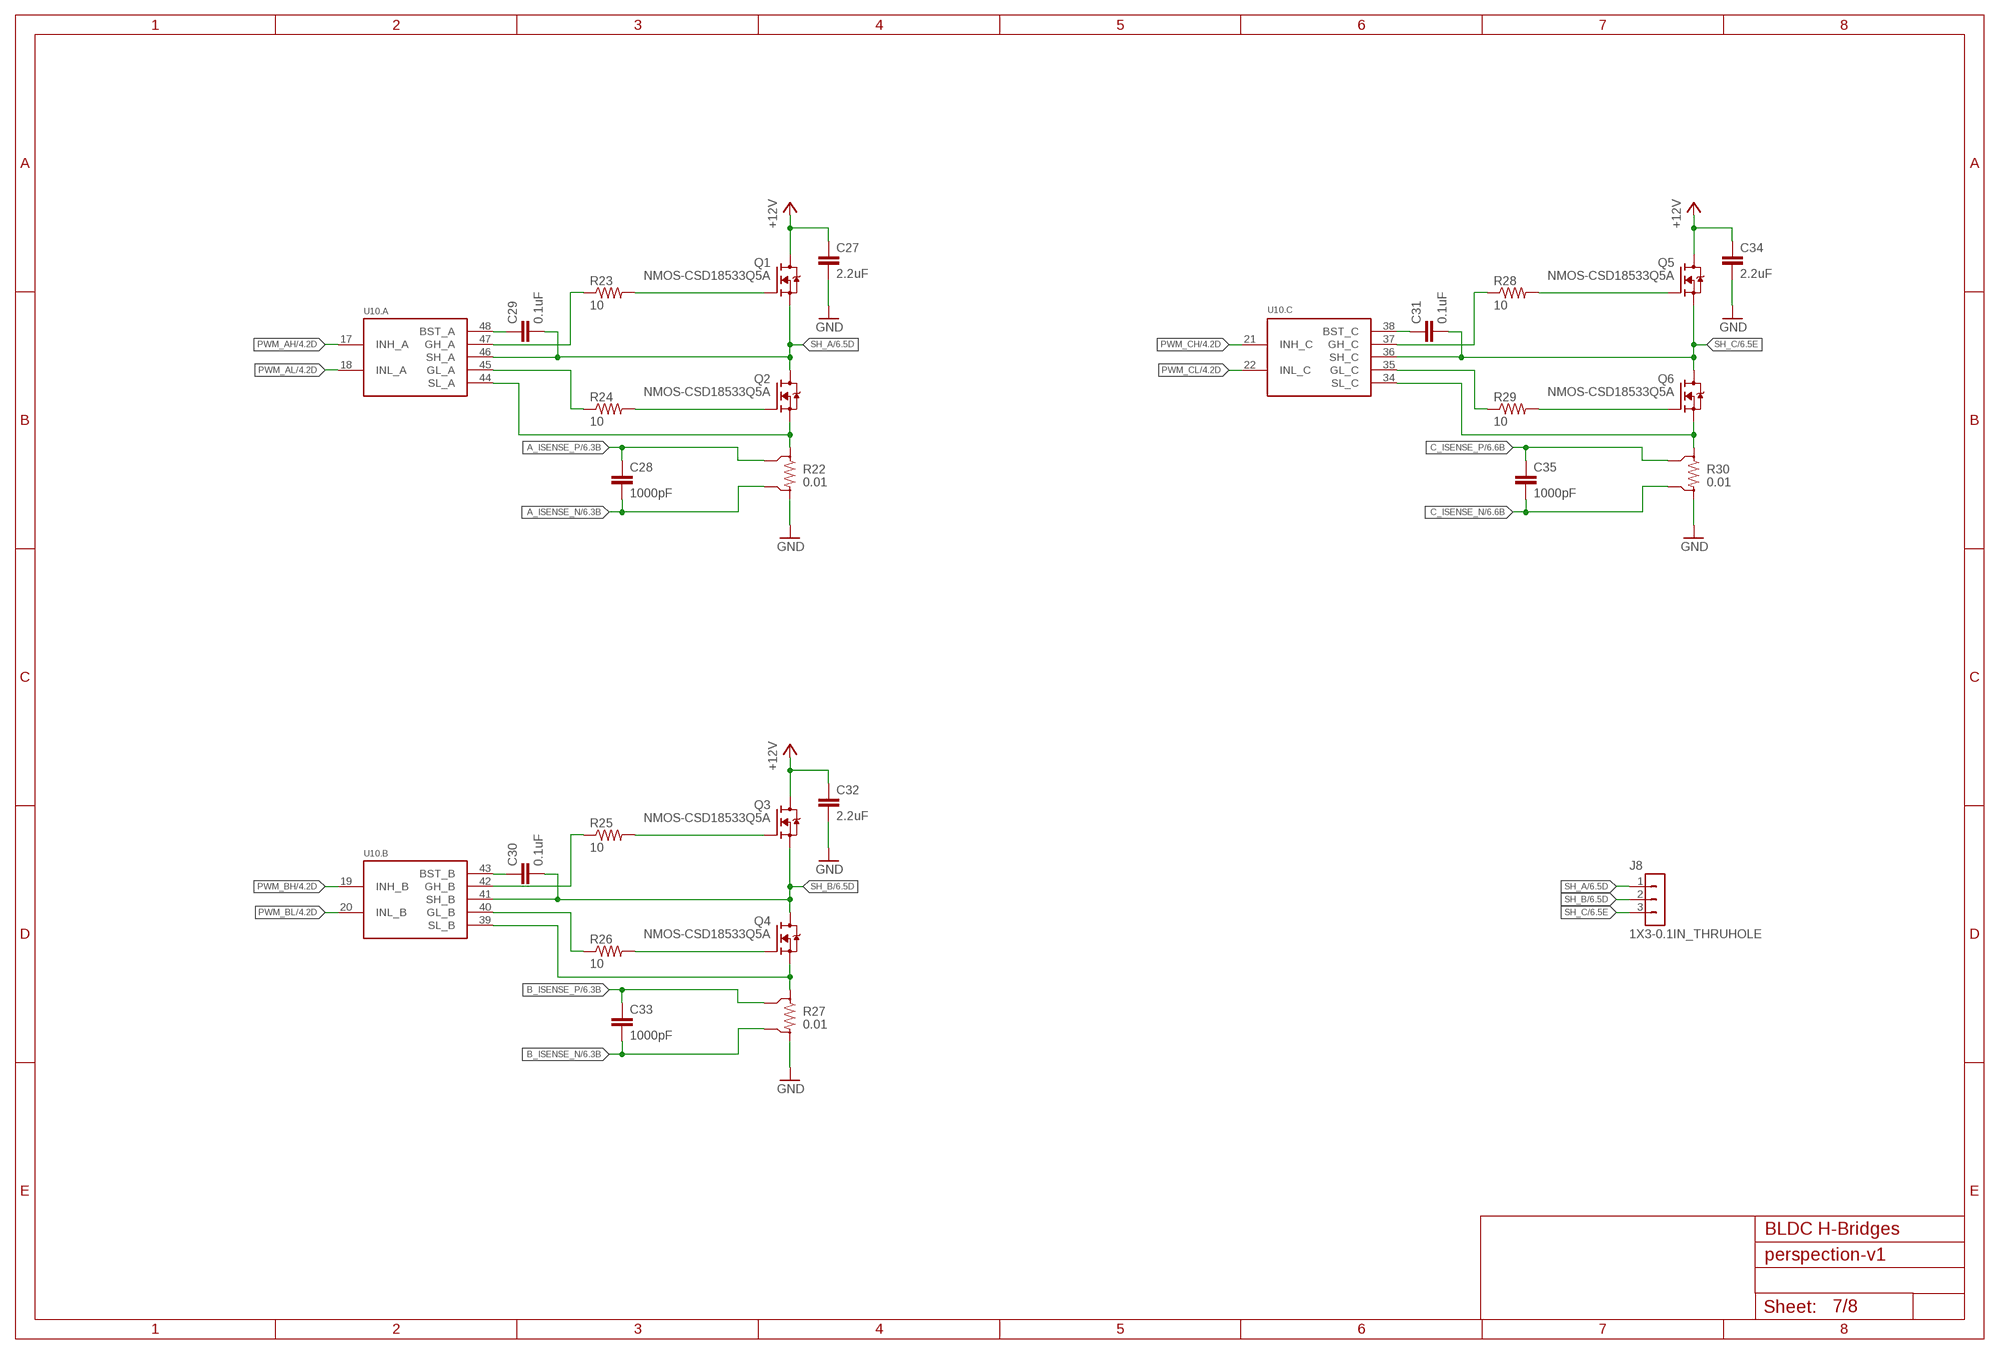
[diagram p6: schematic, sheet 7]

### Parts
C27  2.2uF  C1210  [C1210]
C28  1000pF  C0402  [C0402]
C29  0.1uF  C0402  [C0402]
C30  0.1uF  C0402  [C0402]
C31  0.1uF  C0402  [C0402]
C32  2.2uF  C1210  [C1210]
C33  1000pF  C0402  [C0402]
C34  2.2uF  C1210  [C1210]
C35  1000pF  C0402  [C0402]
J8  1X3-0.1IN_THRUHOLE  [1X3_0.1IN_THRUHOLE]
Q1  NMOS-CSD18533Q5A  [SON-5X6]
Q2  NMOS-CSD18533Q5A  [SON-5X6]
Q3  NMOS-CSD18533Q5A  [SON-5X6]
Q4  NMOS-CSD18533Q5A  [SON-5X6]
Q5  NMOS-CSD18533Q5A  [SON-5X6]
Q6  NMOS-CSD18533Q5A  [SON-5X6]
R22  0.01  R-SENSE2010-0.01  [R2010-4]
R23  10  R0402  [R0402]
R24  10  R0402  [R0402]
R25  10  R0402  [R0402]
R26  10  R0402  [R0402]
R27  0.01  R-SENSE2010-0.01  [R2010-4]
R28  10  R0402  [R0402]
R29  10  R0402  [R0402]
R30  0.01  R-SENSE2010-0.01  [R2010-4]

### Nets
+12V: C27.1 C32.1 C34.1 Q1.D Q3.D Q5.D ; also sheet 3,5,6,8
A_ISENSE_N: C28.2 R22.V2(S2) ; also sheet 6
A_ISENSE_P: C28.1 R22.V1(S1) ; also sheet 6
B_ISENSE_N: C33.2 R27.V2(S2) ; also sheet 6
B_ISENSE_P: C33.1 R27.V1(S1) ; also sheet 6
C_ISENSE_N: C35.2 R30.V2(S2) ; also sheet 6
C_ISENSE_P: C35.1 R30.V1(S1) ; also sheet 6
GH_A: R23.1 U10.47(.A:GH_A)
GH_B: R25.1 U10.42(.B:GH_B)
GH_C: R28.1 U10.37(.C:GH_C)
GL_A: R24.1 U10.45(.A:GL_A)
GL_B: R26.1 U10.40(.B:GL_B)
GL_C: R29.1 U10.35(.C:GL_C)
GND: C27.2 C32.2 C34.2 R22.I2 R27.I2 R30.I2 ; also sheet 2,3,4,5,6,8
N$33: C29.1 U10.48(.A:BST_A)
N$34: Q3.G R25.2
N$35: Q1.G R23.2
N$36: Q2.G R24.2
N$37: Q4.G R26.2
N$38: Q5.G R28.2
N$39: Q6.G R29.2
N$40: C30.1 U10.43(.B:BST_B)
N$45: C31.1 U10.38(.C:BST_C)
PWM_AH: U10.17(.A:INH_A) ; also sheet 4
PWM_AL: U10.18(.A:INL_A) ; also sheet 4
PWM_BH: U10.19(.B:INH_B) ; also sheet 4
PWM_BL: U10.20(.B:INL_B) ; also sheet 4
PWM_CH: U10.21(.C:INH_C) ; also sheet 4
PWM_CL: U10.22(.C:INL_C) ; also sheet 4
SH_A: C29.2 J8.1 Q1.S1(S) Q1.S2(S) Q1.S3(S) Q2.D U10.46(.A:SH_A) ; also sheet 6
SH_B: C30.2 J8.2 Q3.S1(S) Q3.S2(S) Q3.S3(S) Q4.D U10.41(.B:SH_B) ; also sheet 6
SH_C: C31.2 J8.3 Q5.S1(S) Q5.S2(S) Q5.S3(S) Q6.D U10.36(.C:SH_C) ; also sheet 6
SL_A: Q2.S1(S) Q2.S2(S) Q2.S3(S) R22.I1 U10.44(.A:SL_A)
SL_B: Q4.S1(S) Q4.S2(S) Q4.S3(S) R27.I1 U10.39(.B:SL_B)
SL_C: Q6.S1(S) Q6.S2(S) Q6.S3(S) R30.I1 U10.34(.C:SL_C)

## Sheet 8 of 8
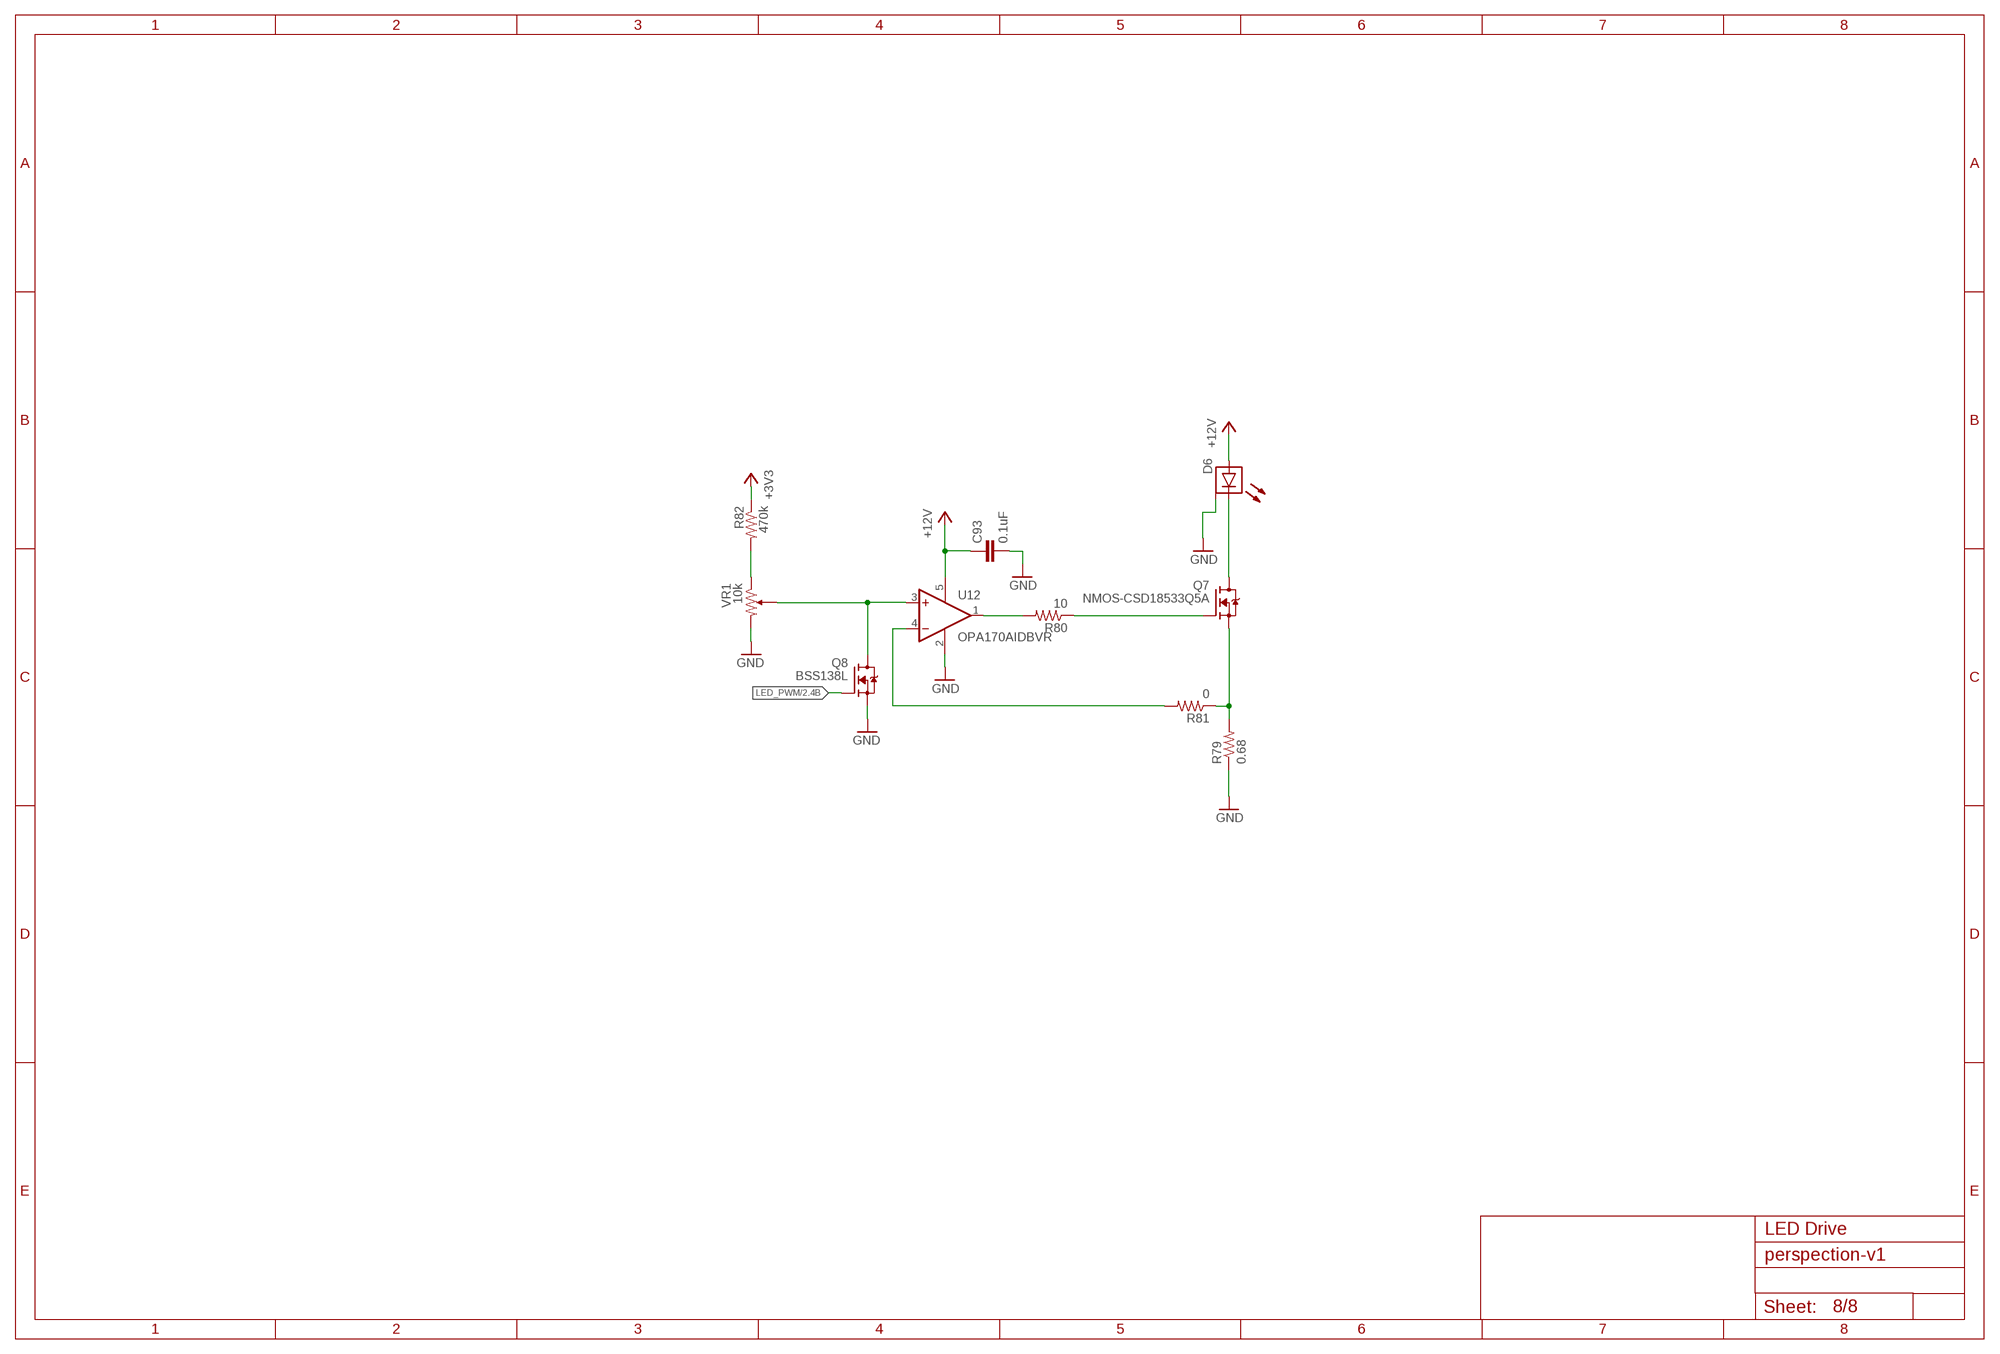
[diagram p7: schematic, sheet 8]

### Parts
C93  0.1uF  C0402  [C0402]
D6  LED-PWR-XLAMP_MX3  [XLAMP-MX3]
Q7  NMOS-CSD18533Q5A  [SON-5X6]
Q8  BSS138L  [SOT23]
R79  0.68  R0805  [R0805]
R80  10  R0402  [R0402]
R81  0  R0402  [R0402]
R82  470k  R0402  [R0402]
U12  OPA170AIDBVR  [SOT23-5]
VR1  10k  R-TRIM-ST4ETA204  [ST-4EA]

### Nets
+3V3: R82.1 ; also sheet 2,3,4,5,6
+12V: C93.1 D6.ANODE U12.5(V+) ; also sheet 3,5,6,7
GND: C93.2 D6.THERM1(HEAT) D6.THERM2(HEAT) D6.THERM3(HEAT) D6.THERM4(HEAT) D6.THERM5(HEAT) D6.THERM6(HEAT) D6.THERM7(HEAT) D6.THERM8(HEAT) D6.THERM9(HEAT) D6.THERM10(HEAT) D6.THERM11(HEAT) D6.THERM(HEAT) Q8.2(S) R79.1 U12.2(V-) VR1.3 ; also sheet 2,3,4,5,6,7
LED_PWM: Q8.1(G) ; also sheet 2
N$59: D6.CATHODE Q7.D
N$60: Q7.S1(S) Q7.S2(S) Q7.S3(S) R79.2 R81.1
N$61: Q7.G R80.1
N$62: R81.2 U12.4(-IN)
N$63: R82.2 VR1.1
N$83: Q8.3(D) U12.3(+IN) VR1.2(WIPER)
N$84: R80.2 U12.1(OUT)

## Library data of the parts
C1-C81 C88-C96 = perspection:C
C82-C87 = perspection:CPOL: CAP ALUM 220UF 20% 25V SMD Digi-key Page <http://www.digikey.com/product-detail/en/EEE-FTE221XAP/PCE5009CT-ND/2652064>; DIST_NAME: Digi-Key; DIST_PN: PCE5009CT-ND; MFG_NAME: Panasonic Electronic Components; MFG_PN: EEE-FTE221XAP
D1 = perspection:LED: LED GREEN CLEAR 0603 SMD Digi-key Page <http://www.digikey.com/product-detail/en/LTST-C191KGKT/160-1446-1-ND/386834>; COLOR: GREEN; DIST_NAME: Digi-Key; DIST_PN: 160-1446-1-ND; MFG_NAME: Lite-On Inc.; MFG_PN: LTST-C191KGKT
D2 D4 = perspection:LED: LED GREEN CLEAR 0603 SMD Digi-key Page <http://www.digikey.com/product-detail/en/LTST-C191KGKT/160-1446-1-ND/386834>; COLOR: RED; DIST_NAME: Digi-Key; DIST_PN: 160-1446-1-ND; MFG_NAME: Lite-On Inc.; MFG_PN: LTST-C191KGKT
D3 = perspection:LED: LED GREEN CLEAR 0603 SMD Digi-key Page <http://www.digikey.com/product-detail/en/LTST-C191KGKT/160-1446-1-ND/386834>; COLOR: BLUE; DIST_NAME: Digi-Key; DIST_PN: 160-1446-1-ND; MFG_NAME: Lite-On Inc.; MFG_PN: LTST-C191KGKT
D5 = perspection:B220A-13-F: DIODE SCHOTTKY 20V 2A SMA Digi-key Page <http://www.digikey.com/product-detail/en/B220A-13-F/B220A-FDICT-ND/751528>; DIST_NAME: Digi-Key; DIST_PN: B220A-FDICT-ND; MFG_NAME: Diodes Incorporated; MFG_PN: B220A-13-F
D6 = perspection:LED-PWR: LED XLAMP NEUTRAL WHT 4000K 2SMD Digi-key Page <http://www.digikey.com/product-detail/en/MX3SWT-A1-0000-000CE5/MX3SWT-A1-0000-000CE5CT-ND/2421169>; DIST_NAME: Digi-Key; DIST_PN: MX3SWT-A1-0000-000CE5CT-ND; MFG_NAME: Cree Inc.; MFG_PN: MX3SWT-A1-0000-000CE5
J1 = perspection:MICRO-USB: Connector Receptacle USB - micro B 2.0 5 Position Surface Mount, Right Angle, Horizontal Digi-key page <http://www.digikey.com/product-detail/en/10118192-0001LF/609-4613-1-ND/2785378>; DIST_NAME: Digi-Key; DIST_PN: 609-4613-1-ND; MFG_NAME: FCI; MFG_PN: 10118192-0001LF
J2 = perspection:1X6: TERM BLOCK PCB 6POS 3.5MM GREEN Digi-key Page <http://www.digikey.com/product-detail/en/1985234/277-1626-ND/568663>; DIST_NAME: Digi-Key; DIST_PN: 277-1626-ND; MFG_NAME: Phoenix Contact; MFG_PN: 1985234
J3 J9 = perspection:1X2: TERM BLOCK PCB 2POS 3.5MM GREEN Digi-key Page <http://www.digikey.com/product-detail/en/1985195/277-1622-ND/568659>; DIST_NAME: Digi-Key; DIST_PN: 277-1622-ND; MFG_NAME: Phoenix Contact; MFG_PN: 1985195
J4 = perspection:1X2: TERM BLOCK PCB 2POS 3.5MM GREEN Digi-key Page <http://www.digikey.com/product-detail/en/1985195/277-1622-ND/568659>; DIST_NAME: Digi-Key; DIST_PN: 455-1749-1-ND; MFG_NAME: JST Sales America Inc.; MFG_PN: S2B-PH-SM4-TB(LF)(SN)
J5 = perspection:1X2: TERM BLOCK PCB 2POS 3.5MM GREEN Digi-key Page <http://www.digikey.com/product-detail/en/1985195/277-1622-ND/568659>
J6 J7 = perspection:JTAG-ARM
J8 = perspection:1X3: CONN HEADER 3 POS RA 2.54 Digi-key Page <http://www.digikey.com/product-detail/en/61300311021/732-5336-ND/4846824>; DIST_NAME: Digi-Key; DIST_PN: 732-5336-ND; MFG_NAME: Wurth Electronics Inc; MFG_PN: 61300311021
J10 = perspection:1X5
J11 = perspection:1X4
L1 = perspection:L; DIST_NAME: Digi-key; DIST_PN: 240-2373-1-ND; MFG_NAME: Laird-Signal Integrity Products; MFG_PN: MI0603K300R-10
L2 = perspection:DR74: FIXED IND 33UH 1.41A 143 MOHM Digi-key Page <http://www.digikey.com/product-detail/en/DR74-330-R/513-1141-1-ND/754639>; DIST_NAME: Digi-Key; DIST_PN: 513-1141-1-ND; MFG_NAME: Eaton Bussmann; MFG_PN: DR74-330-R
L3 L5 = perspection:L; DIST_NAME: Digi-key; DIST_PN: 490-5201-1-ND; MFG_NAME: Murata Electronics North America; MFG_PN: BLM15PD600SN1D
L4 = perspection:L
Q1-Q7 Q10 = perspection:NMOS: MOSFET N-CH 55V 540MA SOT23 Digi-key Page <http://www.digikey.com/product-detail/en/BSS670S2L%20H6327/BSS670S2L%20H6327CT-ND/3196653>; DIST_NAME: Digi-Key; DIST_PN: 296-35027-1-ND; MFG_NAME: Texas Instruments; MFG_PN: CSD18533Q5A
Q8 Q9 = perspection:BSS138L: MOSFET N-CH 50V 0.2A SOT-23 Digi-key Page <http://www.digikey.com/product-detail/en/BSS138L/BSS138LCT-ND/5044761>; DIST_NAME: Digi-Key; DIST_PN: BSS138LCT-ND; MFG_NAME: Fairchild Semiconductor; MFG_PN: BSS138L
Q11 = perspection:IRFML8244TRPBF: MOSFET N-CH 25V 5.8A SOT23 Digi-key Page <http://www.digikey.com/product-detail/en/IRFML8244TRPBF/IRFML8244TRPBFCT-ND/2538166>; DIST_NAME: Digi-Key; DIST_PN: IRFML8244TRPBFCT-ND; MFG_NAME: Infineon Technologies Americas Corp.; MFG_PN: IRFML8244TRPBF
R1-R5 R7-R11 R13-R15 R17 R18 R20 R21 R23-R26 R28 R29 R31-R126 = perspection:R
R6 R12 R16 R19 = perspection:R; DIST_NAME: Digi-key; DIST_PN: 1276-6179-1-ND; MFG_NAME: Samsung Electro-Mechanics America, Inc.; MFG_PN: RUT3216FR330CS
R22 R27 R30 = perspection:R-SENSE: RES SMD 0.01 OHM 0.5% 3/4W 2010 Digi-key Page <http://www.digikey.com/product-detail/en/LVK20R010DER/LVK20R010DERCT-ND/1632808>; DIST_NAME: Digi-Key; DIST_PN: LVK20R010DERCT-ND; MFG_NAME: Ohmite; MFG_PN: LVK20R010DER
S1 = perspection:TACTILE-SWITCH: SWITCH TACTILE SPST-NO 0.05A 24V Digi-key Page <http://www.digikey.com/product-search/en/switches/tactile-switches/1114206?k=450-1129-ND>; DIST_NAME: Digi-Key; DIST_PN: P11084SCT-ND; MFG_NAME: Panasonic Electronic Components; MFG_PN: EVQ-P2K02Q
S2 = perspection:SSA22/DPDT: SWITCH SLIDE DPDT 100MA 30V Digi-key Page <http://www.digikey.com/product-detail/en/SSA22/450-1604-ND/1201307>; DIST_NAME: Digi-Key; DIST_PN: 450-1604-ND; MFG_NAME: TE Connectivity Alcoswitch Switches; MFG_PN: SSA22
U1 = perspection:ATUM: Atum sensorboard prototyping module.
U2 = perspection:FT232R: Source: http://www.ftdichip.com/Documents/DataSheets/DS_FT232R_v104.pdf; MPN: FT232RQ; OC_FARNELL: 1146033; OC_NEWARK: 91K9919
U3 = perspection:TPS799: IC REG LDO 3.3V 0.2A 5SOT Digi-key Page <http://www.digikey.com/product-detail/en/TPS79933DDCR/296-17783-1-ND/717470>; DIST_NAME: Digi-Key; DIST_PN: 296-17783-1-ND; MFG_NAME: Texas Instruments; MFG_PN: TPS79933DDCR
U4 = perspection:MCP73831: IC CONTROLLR LI-ION 4.2V SOT23-5 Digi-key Page <http://www.digikey.com/product-detail/en/MCP73831T-2ACI%2FOT/MCP73831T-2ACI%2FOTCT-ND/1979802>; DIST_NAME: Digi-Key; DIST_PN: MCP73831T-2ACI/OTCT-ND; MFG_NAME: Microchip Technology; MFG_PN: MCP73831T-2ACI/OT
U5 = perspection:TMS320F28069M: IC MCU 32BIT 256KB FLASH 100LQFP Digi-key Page <http://www.digikey.com/product-detail/en/TMS320F28069MPZT/296-36224-5-ND/3789658>; DIST_NAME: Digi-Key; DIST_PN: 296-36224-5-ND; MFG_NAME: Texas Instruments; MFG_PN: TMS320F28069MPZT
U6-U9 = perspection:DRV8801: IC MOTOR DRIVER PAR 16HTSSOP Digi-key Page <http://www.digikey.com/product-detail/en/DRV8801PWPR/296-25378-1-ND/2183149>; DIST_NAME: Digi-Key; DIST_PN: 296-25378-1-ND; MFG_NAME: Texas Instruments; MFG_PN: DRV8801PWPR
U10 = perspection:DRV8301: IC MOTOR CONTROLLER SPI 56HTSSOP Digi-key Page <http://www.digikey.com/product-detail/en/DRV8301DCAR/296-29433-1-ND/2743170>; DIST_NAME: Digi-Key; DIST_PN: 296-29433-1-ND; MFG_NAME: Texas Instruments; MFG_PN: DRV8301DCAR
U11 = perspection:OPA2374: IC OPAMP GP 6.5MHZ RRO SOT23-8 Digi-key Page <http://www.digikey.com/product-detail/en/OPA2374AIDCNR/296-37645-1-ND/4833881>; DIST_NAME: Digi-Key; DIST_PN: 296-37645-1-ND; MFG_NAME: Texas Instruments; MFG_PN: OPA2374AIDCNR
U12 = perspection:OPA170: IC OPAMP GP 1.2MHZ RRO SOT23-5 Digi-key Page <http://www.digikey.com/product-detail/en/OPA170AIDBVT/296-29496-1-ND/2748511>; DIST_NAME: Digi-Key; DIST_PN: 296-29496-1-ND; MFG_NAME: Texas Instruments; MFG_PN: OPA170AIDBVT
U13 = perspection:BNO055; DIST_NAME: Mouser; DIST_PN: 262-BNO055; MFG_NAME: Bosch Sensortec; MFG_PN: BNO055
U14 = perspection:TPS81256: IC REG BOOST 5V SYNC 9USIP Digi-key Page <http://www.digikey.com/product-detail/en/TPS81256SIPR/296-30558-1-ND/3466794>; DIST_NAME: Digi-Key; DIST_PN: 296-30558-1-ND; MFG_NAME: Texas Instruments; MFG_PN: TPS81256SIPR
VR1 = perspection:R-TRIM: TRIMMER 10K OHM 0.25W SMD Digi-key Page <http://www.digikey.com/product-detail/en/ST4ETA103/ST4ETA103CT-ND/738497>; DIST_NAME: Digi-Key; DIST_PN: ST4ETA103CT-ND; MFG_NAME: Copal Electronics Inc.; MFG_PN: ST4ETA103
Y1 = perspection:CM200C: Crystal 32.7680kHz 5ppm 12.5pF 50 kOhm -40C - 85C Surface Mount 4-SOJ, 5.50mm pitch Digi-key Page <http://www.digikey.com/product-detail/en/CM200C32768HZFT/300-8742-1-ND/2108134>; DIST_NAME: Digi-Key; DIST_PN: 300-8742-1-ND; MFG_NAME: Citizen Finedevice Co Ltd; MFG_PN: CM200C32768HZFT